# Altium project RYA_ESC.PrjPcb (part 1 of 2)
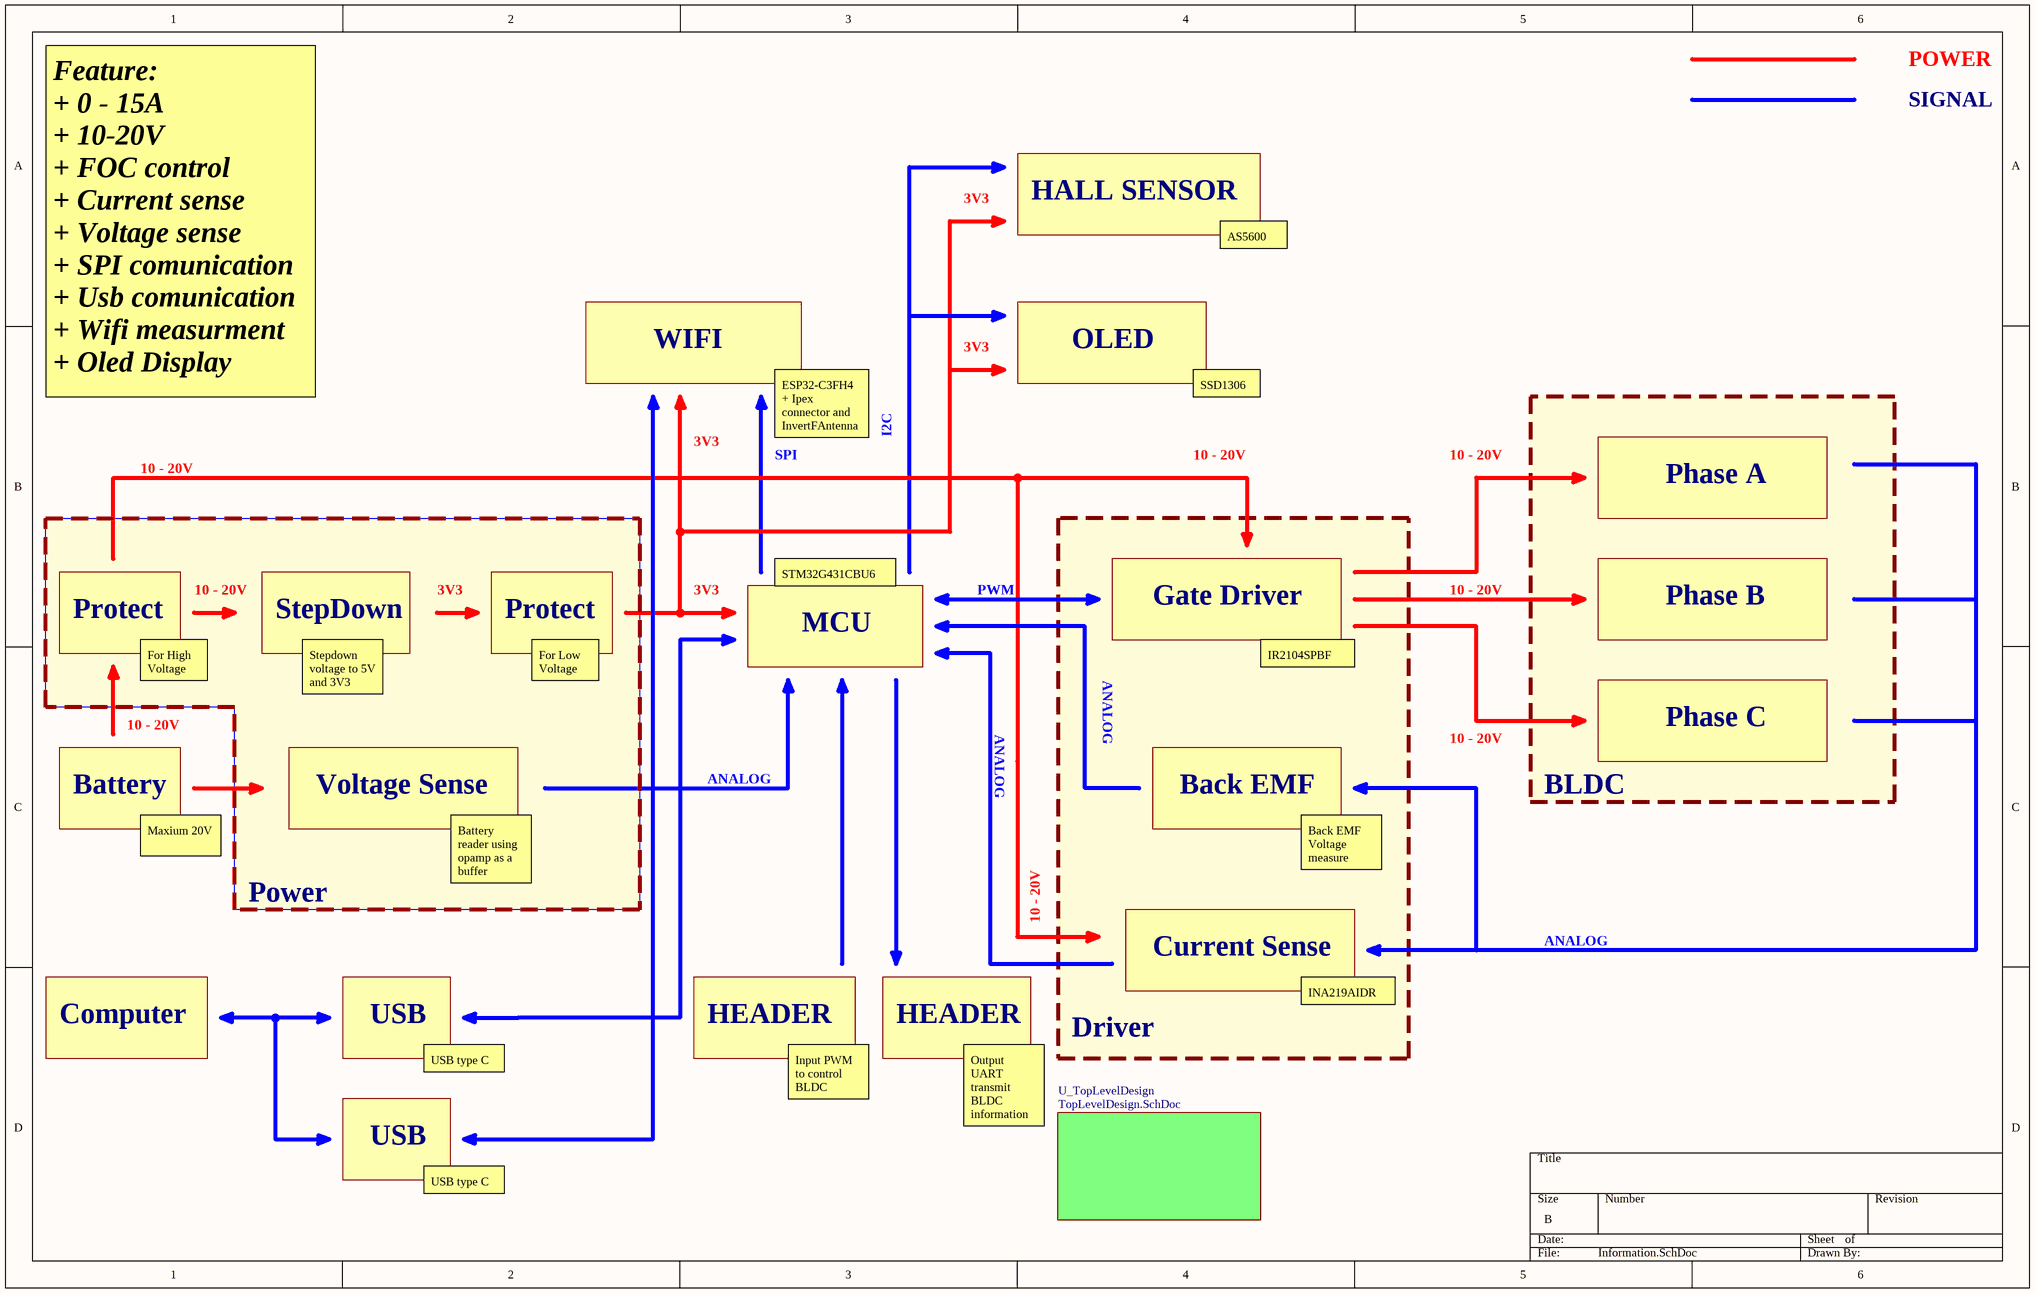
[diagram p0: Information.SchDoc]
15 sheets, 309 parts. Net scope: flat (ports and power ports of the same name join across sheets).
Board files: RYA_ESC.PcbDoc, Test.PcbDoc
Sheets:
  Information.SchDoc
    U_TopLevelDesign = TopLevelDesign.SchDoc
      ESP_USB = USB.SchDoc
      STM_USB = USB.SchDoc
      U_MCU = MCU.SchDoc
      U_OLED = OLED.SchDoc
      U_Wifi = Wifi.SchDoc
      U_Power = Power.SchDoc
        HighPowerProtect = HiPowerProtect.SchDoc
        U_Power = StepDown.SchDoc
          U_5VProtect = 5VProtect.SchDoc
        U_BattVoltSense = BattVoltSense.SchDoc
      U_Driver = Driver.SchDoc
        I_PhaseB = CurrentSense.SchDoc
        I_PhaseC = CurrentSense.SchDoc
        I_PhaseA = CurrentSense.SchDoc
        U_BackEMF = BackEMF.SchDoc
        PhaseB = GateDriver.SchDoc
        PhaseC = GateDriver.SchDoc
        PhaseA = GateDriver.SchDoc

## Sheet Information.SchDoc
size B; SheetNumber: 1; SheetTotal: 15

### Sub-sheets
U_TopLevelDesign = TopLevelDesign.SchDoc: no entries

### Notes on the sheet
- POWER
- SIGNAL
- 3V3
- HALL SENSOR
- AS5600
- WIFI
- OLED
- Feature:
  + 0 - 15A
  + 10-20V
  + FOC control
  + Current sense
  + Voltage sense
  + SPI comunication
  + Usb comunication
  + Wifi measurment
  + Oled Display
- ESP32-C3FH4 + Ipex connector and InvertFAntenna
- I2C
- SSD1306
- 10 - 20V
- SPI
- Phase A
- Protect
- StepDown
- STM32G431CBU6
- MCU
- PWM
- Gate Driver
- Phase B
- For High Voltage
- Stepdown voltage to 5V and 3V3
- For Low Voltage
- ANALOG
- IR2104SPBF
- Phase C
- Battery
- Voltage Sense
- Back EMF
- BLDC
- Maxium 20V
- Power
- Battery reader using opamp as a buffer
- Back EMF Voltage measure
- Current Sense
- Computer
- USB
- HEADER
- Driver
- INA219AIDR
- USB type C
- Input PWM to control BLDC
- Output UART transmit BLDC information

## Sheet TopLevelDesign.SchDoc
size B; SheetNumber: 2; SheetTotal: 15
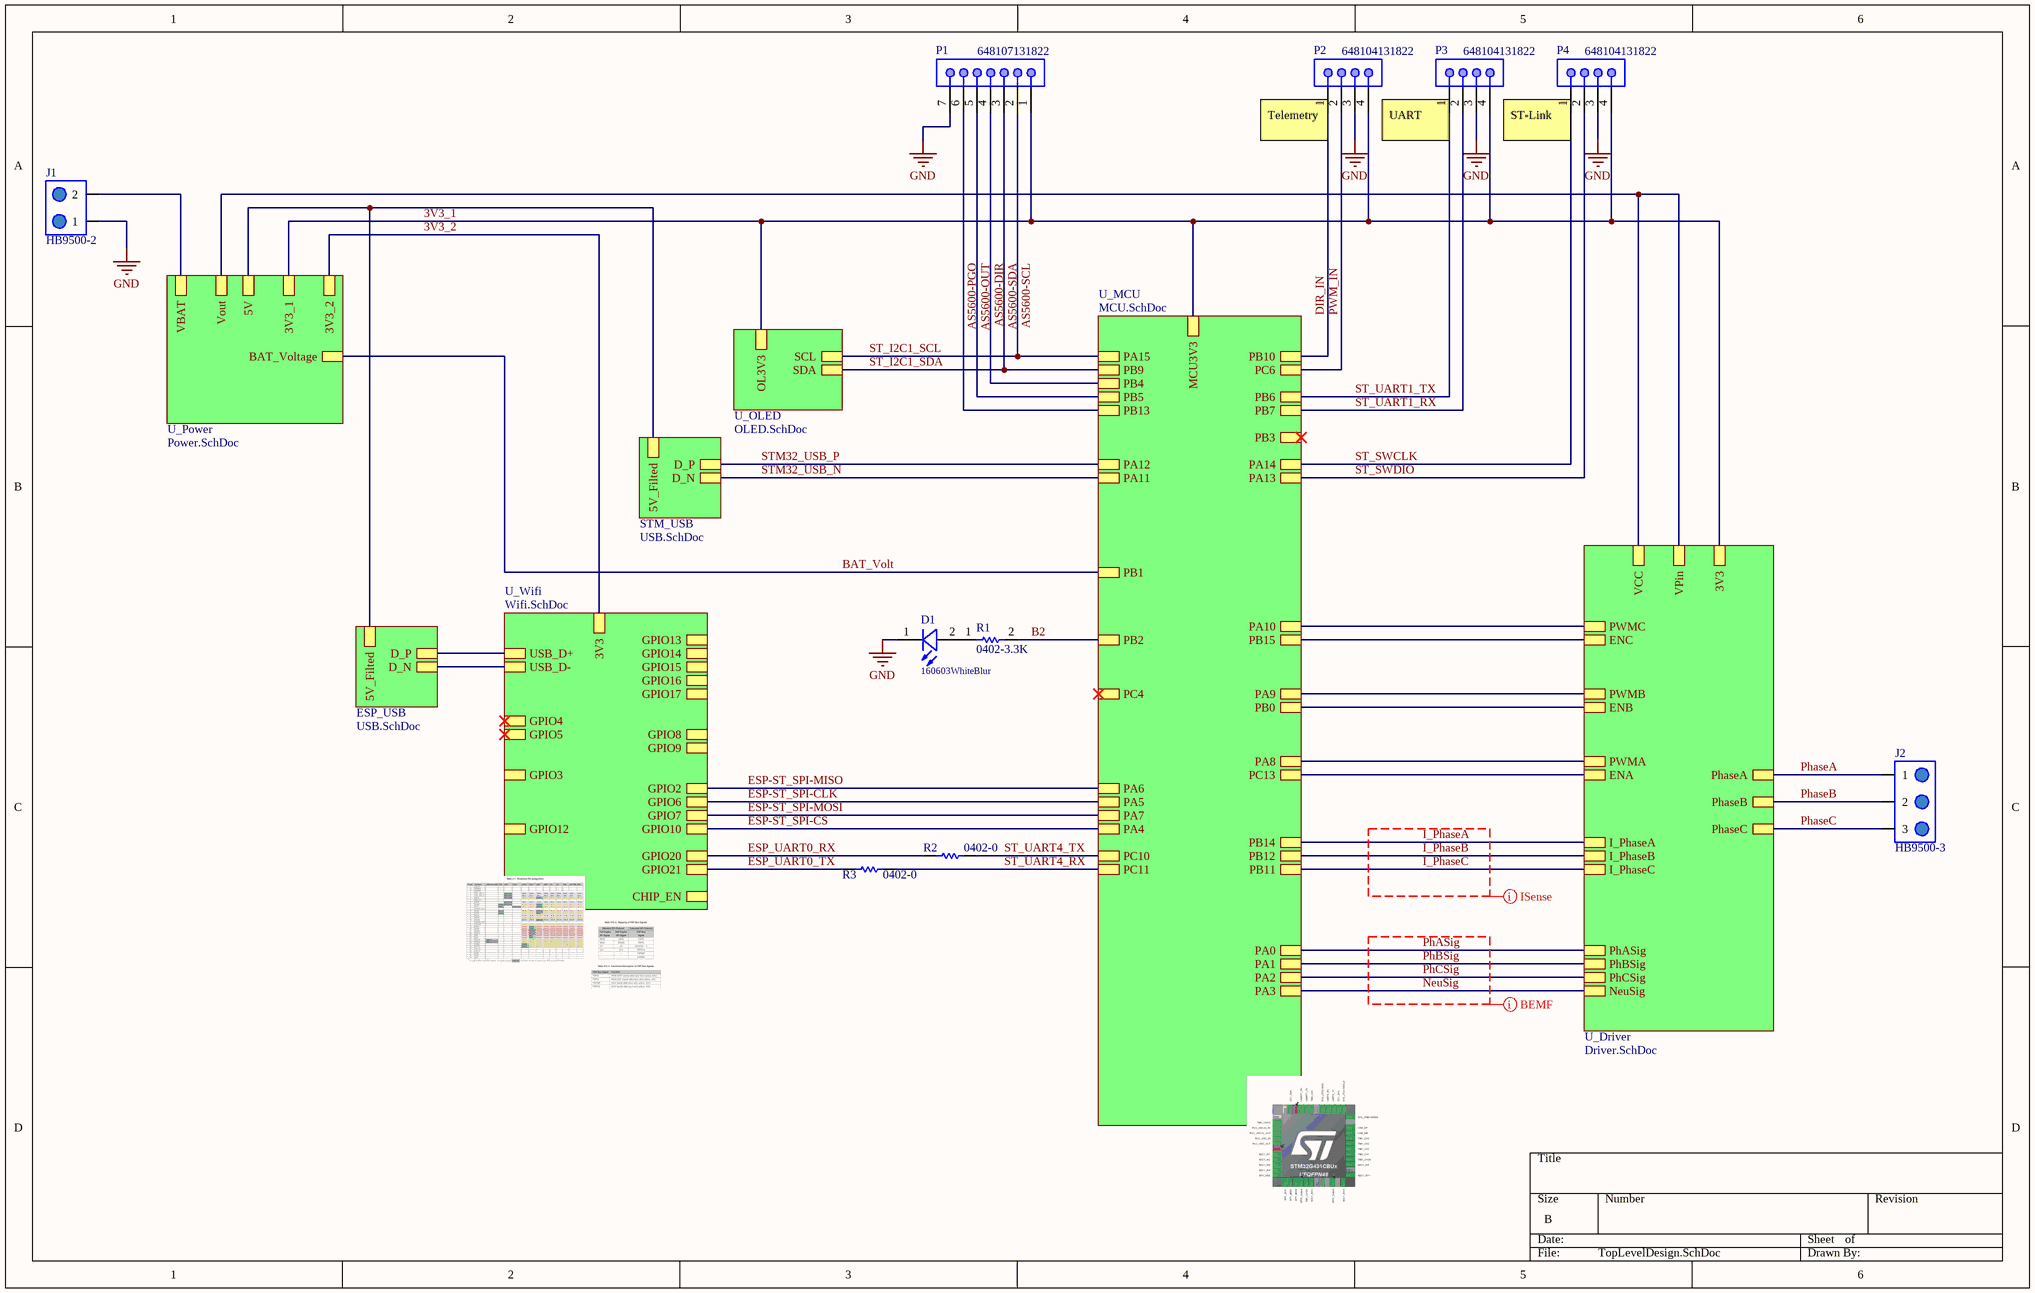
[diagram p1: TopLevelDesign.SchDoc]

### Parts
D1  160603WhiteBlur  [WL-SMCW_0603_H=0.7mm]
J1  HB9500-2  [HB9500-2]
J2  HB9500-3  [HB9500-3]
P1  648107131822  [648107131822]
P2  648104131822  [648104131822]
P3  648104131822  [648104131822]
P4  648104131822  [648104131822]
R1  0402-3.3K  [R-0402-10K]
R2  0402-0  [R-0402-1K]
R3  0402-0  [R-0402-1K]

### Sub-sheets
ESP_USB = USB.SchDoc: D_N, D_P, 5V_Filted
STM_USB = USB.SchDoc: D_N, D_P, 5V_Filted
U_Driver = Driver.SchDoc: VCC, VPin, 3V3, PhaseC, PhaseB, PhaseA, PWMC, ENC, PWMB, ENB, PWMA, ENA, I_PhaseC, I_PhaseB, I_PhaseA, PhASig, PhBSig, PhCSig, NeuSig
U_MCU = MCU.SchDoc: PB0, PB1, PB2, PB3, PB4, PB5, PB6, PB7, PB9, PB10, PB11, PB12, PB13, PB14, PB15, PC4, PC6, PC10, PC11, PC13, PA0, PA1, PA2, PA3, PA4, PA5, PA6, PA7, PA8, PA9, PA10, PA11, PA12, PA13, PA14, PA15, MCU3V3
U_OLED = OLED.SchDoc: OL3V3, SCL, SDA
U_Power = Power.SchDoc: VBAT, BAT_Voltage, 5V, 3V3_1, Vout, 3V3_2
U_Wifi = Wifi.SchDoc: 3V3, USB_D-, USB_D+, GPIO8, GPIO9, GPIO10, GPIO4, GPIO5, GPIO6, GPIO7, GPIO2, GPIO3, CHIP_EN, GPIO20, GPIO21, GPIO12, GPIO13, GPIO14, GPIO15, GPIO16, GPIO17

### Nets
GND: D1.1(K) J1.1 P1.7 P2.3 P3.3 P4.3
3V3_1: P1.1 P2.4 P3.4 P4.4 ; sheet U_MCU/MCU3V3, sheet U_OLED/OL3V3, sheet U_Power/3V3_1, sheet U_Driver/3V3
3V3_2: sheet U_Wifi/3V3, sheet U_Power/3V3_2
AS5600-DIR: P1.4 ; sheet U_MCU/PB4
AS5600-OUT: P1.5 ; sheet U_MCU/PB5
AS5600-PGO: P1.6 ; sheet U_MCU/PB13
AS5600-SCL: P1.2 ; sheet U_MCU/PA15, sheet U_OLED/SCL  [also labelled ST_I2C1_SCL]
AS5600-SDA: P1.3 ; sheet U_MCU/PB9, sheet U_OLED/SDA  [also labelled ST_I2C1_SDA]
B2: R1.2 ; sheet U_MCU/PB2
BAT_Volt: sheet U_MCU/PB1, sheet U_Power/BAT_Voltage
DIR_IN: P2.1 ; sheet U_MCU/PB10
ESP-ST_SPI-CLK: sheet U_MCU/PA5, sheet U_Wifi/GPIO6
ESP-ST_SPI-CS: sheet U_MCU/PA4, sheet U_Wifi/GPIO10
ESP-ST_SPI-MISO: sheet U_MCU/PA6, sheet U_Wifi/GPIO2
ESP-ST_SPI-MOSI: sheet U_MCU/PA7, sheet U_Wifi/GPIO7
ESP_UART0_RX: R2.1 ; sheet U_Wifi/GPIO20
ESP_UART0_TX: R3.1 ; sheet U_Wifi/GPIO21
I_PhaseA: sheet U_MCU/PB14, sheet U_Driver/I_PhaseA
I_PhaseB: sheet U_MCU/PB12, sheet U_Driver/I_PhaseB
I_PhaseC: sheet U_MCU/PB11, sheet U_Driver/I_PhaseC
NeuSig: sheet U_MCU/PA3, sheet U_Driver/NeuSig
PhaseA: J2.1 ; sheet U_Driver/PhaseA
PhaseB: J2.2 ; sheet U_Driver/PhaseB
PhaseC: J2.3 ; sheet U_Driver/PhaseC
PhASig: sheet U_MCU/PA0, sheet U_Driver/PhASig
PhBSig: sheet U_MCU/PA1, sheet U_Driver/PhBSig
PhCSig: sheet U_MCU/PA2, sheet U_Driver/PhCSig
PWM_IN: P2.2 ; sheet U_MCU/PC6
ST_SWCLK: P4.1 ; sheet U_MCU/PA14
ST_SWDIO: P4.2 ; sheet U_MCU/PA13
ST_UART1_RX: P3.2 ; sheet U_MCU/PB7
ST_UART1_TX: P3.1 ; sheet U_MCU/PB6
ST_UART4_RX: R3.2 ; sheet U_MCU/PC11
ST_UART4_TX: R2.2 ; sheet U_MCU/PC10
STM32_USB_N: sheet STM_USB/D_N, sheet U_MCU/PA11
STM32_USB_P: sheet STM_USB/D_P, sheet U_MCU/PA12
NetD1_2: D1.2(A) R1.1
NetJ1_2: J1.2 ; sheet U_Power/VBAT
(unnamed): sheet ESP_USB/D_N, sheet U_Wifi/USB_D-
(unnamed): sheet ESP_USB/D_P, sheet U_Wifi/USB_D+
(unnamed): sheet ESP_USB/5V_Filted, sheet STM_USB/5V_Filted, sheet U_Power/5V
(unnamed): sheet U_MCU/PB0, sheet U_Driver/ENB
(unnamed): sheet U_MCU/PB15, sheet U_Driver/ENC
(unnamed): sheet U_MCU/PC13, sheet U_Driver/ENA
(unnamed): sheet U_MCU/PA8, sheet U_Driver/PWMA
(unnamed): sheet U_MCU/PA9, sheet U_Driver/PWMB
(unnamed): sheet U_MCU/PA10, sheet U_Driver/PWMC
(unnamed): sheet U_Power/Vout, sheet U_Driver/VCC, sheet U_Driver/VPin

### Layout directives
net class BEMF: NeuSig, PhASig, PhBSig, PhCSig
net class ISense: I_PhaseA, I_PhaseB, I_PhaseC

### Notes on the sheet
- (near P2) Telemetry
- UART
- ST-Link

### Library data of the parts
D1 = CMP-004-00095-1: WL-SMCW SMT Mono-color Chip LED Blur, size 0603, White; ComponentLink3Description: Supplier 2 URL; Design Item ID: 160603WhiteBlur; Component Type: Standard; Size: 0603; Supplier 1 SN: 755-SMLEN3WBC8W1; Color: White; Supplier 3 Name: ICDayRoi; Supplier 3 URL: N/A; Pins: 2; Supplier 2 URL: https://www.digikey.com/en/products/detail/qt-brightek-qtb/QBLP601-IW/4814655; ComponentLink1URL: N/A; ComponentLink3URL: https://www.digikey.com/en/products/detail/qt-brightek-qtb/QBLP601-IW/4814655; Supplier 1 URL: https://www.mouser.vn/ProductDetail/ROHM-Semiconductor/SMLEN3WBC8W1?qs=W0yvOO0ixfGun78rr9Unsw%3D%3D; ComponentLink2URL: https://www.mouser.vn/ProductDetail/ROHM-Semiconductor/SMLEN3WBC8W1?qs=W0yvOO0ixfGun78rr9Unsw%3D%3D; ComponentLink4Description: Supplier 3 URL; Supplier 1 Name: Mouser; Supplier 3 SN: N/A; ComponentLink4URL: N/A; Source: WL-SMCW_0603.SchLib; Supplier 2 SN: 1516-1057-2-ND; Value: White; Supplier 2 Name: Digi-Key; ComponentLink2Description: Supplier 1 URL; ComponentLink1Description: Datasheet link; Type: Blur
J1 = CMP-118-000008-1: High Power Terminal , 25A , 300V; Pin Count: 2; Component Type: Standard; Design Item ID: HB9500-2; Source: HB9500-2.SchLib
J2 = CMP-118-000006-1: High Power Terminal , 25A , 300V; Design Item ID: HB9500-3; Component Type: Standard; Source: HB9500-3.SchLib; Pin Count: 3
P1 = CMP-002-01153-1: WR-WTB SMT Male Horizontal Shrouded Header, pitch 1.5mm, 7p; Working Voltage: 50VAC; Value: 1A, 50 V (AC); Rated Current: 1A; Contact Resistance: 20mOhm; Withstanding Voltage: 500VAC; Pin Number: 7; Operating Temperature: -25 to +85degC; ComponentLink3URL: https://www.we-online.com/en/components/products/WTB_1_50_SMT_MALE_HORIZONTAL_SHROUDED_HEADER_6481XX131822?sq=648107131822#648107131822; Supplier 2 URL: N/A; Supplier 1 URL: N/A; Supplier 1 Name: Mouser; Supplier 2 SN: N/A; Type: Horizontal; Source: WR-WTB_1.50mm.SchLib; Design Item ID: 648107131822; Supplier 3 SN: N/A; Pitch: 1.5mm; Part Number: 648107131822; Mounting Technology: SMT; ComponentLink1URL: http://www.we-online.de; Publisher: Wurth Elektronik; Packaging: Tape and Reel; ComponentLink3Description: Global Supply; ComponentLink2URL: https://www.we-online.com/catalog/datasheet/648107131822.pdf; Supplier 3 URL: N/A; Pins: 7; Supplier 1 SN: N/A; ComponentLink2Description: Datasheet; Supplier 2 Name: Digi-Key; Supplier 3 Name: thegioiic; ComponentLink1Description: Manufacturer; Component Type: Standard; Gender: Male; Published Date: January 2020
P2-P4 = CMP-002-01150-1: WR-WTB SMT Male Horizontal Shrouded Header, pitch 1.5mm, 4p; Working Voltage: 50VAC; Rated Current: 1A; Contact Resistance: 20mOhm; Pin Number: 4; Value: 1A, 50 V (AC); Withstanding Voltage: 500VAC; ComponentLink4URL: https://www.mouser.vn/ProductDetail/Wurth-Elektronik/648104131822?qs=ZtY9WdtwX57XPjIMVYKZ6w%3D%3D; ComponentLink3URL: https://www.we-online.com/en/components/products/WTB_1_50_SMT_MALE_HORIZONTAL_SHROUDED_HEADER_6481XX131822?sq=648104131822#648104131822; ComponentLink2Description: Datasheet; Supplier 3 URL: N/A; Mounting Technology: SMT; Operating Temperature: -25 to +85degC; Packaging: Tape and Reel; Pins: 4; Component Type: Standard; ComponentLink4Description: Global Supply; Supplier 1 URL: https://www.mouser.vn/ProductDetail/Wurth-Elektronik/648104131822?qs=ZtY9WdtwX57XPjIMVYKZ6w%3D%3D; Supplier 2 URL: N/A; Supplier 3 SN: N/A; Design Item ID: 648104131822; Supplier 1 Name: Mouser; Supplier 2 Name: Digi-Key; Supplier 2 SN: N/A; ComponentLink3Description: Global Supply; Part Number: 648104131822; Supplier 3 Name: thegioiic; Type: Horizontal; Gender: Male; Publisher: Wurth Elektronik; ComponentLink1Description: Manufacturer; Published Date: January 2020; Supplier 1 SN: 710-648104131822; ComponentLink1URL: http://www.we-online.de; Source: WR-WTB_1.50mm.SchLib; ComponentLink2URL: https://www.we-online.com/catalog/datasheet/648104131822.pdf; Pitch: 1.5mm
R1 = CMP-009-00688-1: RES 0402 3.3K; Value: 3.3k
R2 R3 = CMP-009-00678-4: 0402Resistor 0 Ohm; Value: 0

## Sheet USB.SchDoc
size B; SheetNumber: 13; SheetTotal: 15
Used 2 times, as channels U_TopLevelDesign/ESP_USB, U_TopLevelDesign/STM_USB. Parts and nets are listed once, with the designators drawn on the sheet.
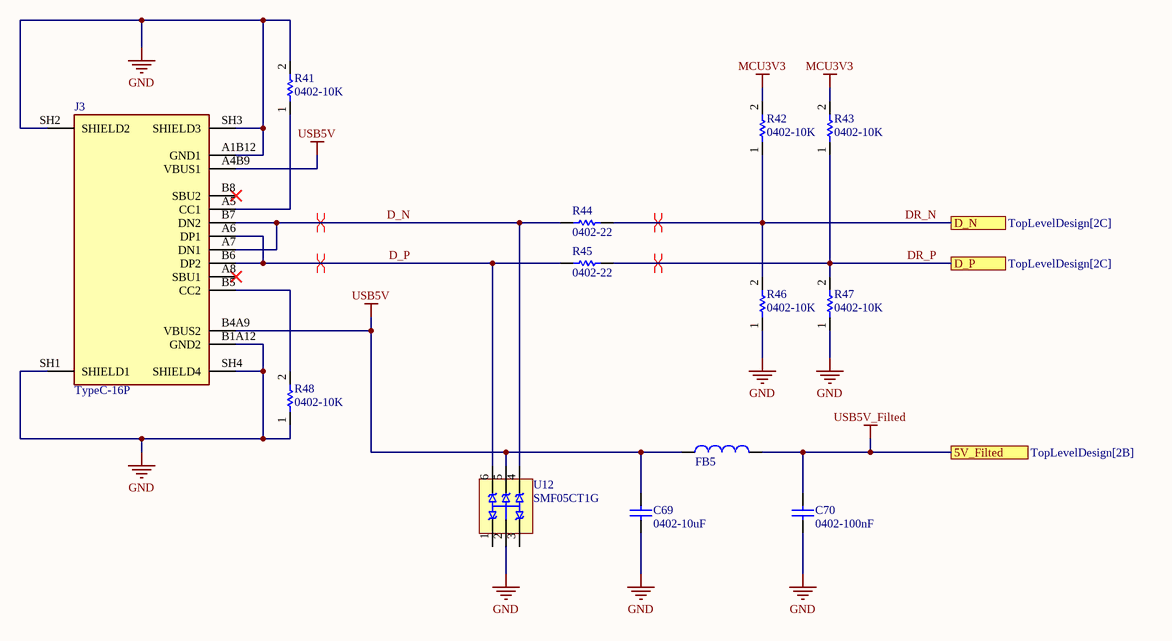
[diagram p2: USB.SchDoc]

### Parts
C69  0402-10uF  [CAPC0402(1005)60_N]
C70  0402-100nF  [CAPC0402(1005)60_N]
FB5  03060360110225  [FER_0603]  (value not drawn)
J3  TypeC-16P  [MOLEX_2171790001]
R41  0402-10K  [R-0402-10K]
R42  0402-10K  [R-0402-10K]
R43  0402-10K  [R-0402-10K]
R44  0402-22  [R-0402-1K]
R45  0402-22  [R-0402-1K]
R46  0402-10K  [R-0402-10K]
R47  0402-10K  [R-0402-10K]
R48  0402-10K  [R-0402-10K]
U12  SMF05CT1G  [SOT65P210X110-6N]

### Ports
5V_Filted (see TopLevelDesign[2B]), D_N (see TopLevelDesign[2C]), D_P (see TopLevelDesign[2C])

### Nets
GND: C69.1 C70.1 J3.A1B12(GND1) J3.B1A12(GND2) J3.SH1(SHIELD1) J3.SH2(SHIELD2) J3.SH3(SHIELD3) J3.SH4(SHIELD4) R41.2 R46.1 R47.1 R48.1 U12.2(A)
MCU3V3: R42.2 R43.2
USB5V: C69.2 FB5.1 J3.A4B9(VBUS1) J3.B4A9(VBUS2) U12.5(C4)
USB5V_Filted: C70.2 FB5.2 ; port 5V_Filted
D_N: J3.A7(DN1) J3.B7(DN2) R44.1 U12.4(C3)
D_P: J3.A6(DP1) J3.B6(DP2) R45.1 U12.6(C5)
DR_N: R42.1 R44.2 R46.2 ; port D_N
DR_P: R43.1 R45.2 R47.2 ; port D_P
NetJ3_A5: J3.A5(CC1) R41.1
NetJ3_B5: J3.B5(CC2) R48.2

Not connected (* = marked no-connect by the designer): J3 A8(SBU1)* B8(SBU2)*; U12 1(C1) 3(C2)

### Channels
U_TopLevelDesign/ESP_USB: designators end in _ESP_USB; ports 5V_Filted=USB5V_Filted D_N=DR_N D_P=DR_P
U_TopLevelDesign/STM_USB: designators end in _STM_USB; ports 5V_Filted=USB5V_Filted D_N=DR_N D_P=DR_P

### Layout directives
differential pair; differential pair class USB_In; rule Matched Net Lengths [Delay Tolerance = 5ps]: D_N_ESP_USB, D_P_ESP_USB
differential pair; differential pair class USB_Out; rule Matched Net Lengths [Delay Tolerance = 5ps]: DR_N, DR_P

### Library data of the parts
C69 = CMP-001-00352-3: Capacitor 10uF 0402s; Tolerance: 20%; Value: 10µF; Dielectric: X5R; Voltage Rating (DC): 4V; Width: 0.02inch; Packaging: Tape and Reel; RoHS Compliant: Yes; Series: M; Mount: Surface Mount; Termination: SMD/SMT; Source: 0402-10uF.SchLib; Design Item ID: CMP-1034-02139-2; Min Operating Temperature: -55°C; Construction: Flat; Component Type: Standard; Case Code (Metric): 1005; Length: 0.039inch; Height: 0.5mm; Pins: 2; Thickness: 0.028inch; Voltage Rating: 4V; Package Quantity: 1; Max Operating Temperature: 85°C; Halogen Free: Halogen Free; Case/Package: 0402
C70 = CMP-001-00354-3: Capacitor 100nF 0402; Tolerance: 20%; Voltage Rating (DC): 4V; Dielectric: X5R; Series: M; RoHS Compliant: Yes; Max Operating Temperature: 85°C; Length: 0.039inch; Thickness: 0.028inch; Mount: Surface Mount; Min Operating Temperature: -55°C; Height: 0.5mm; Packaging: Tape and Reel; Construction: Flat; Termination: SMD/SMT; Source: 0402-10uF.SchLib; Design Item ID: CMP-1034-02139-2; Case/Package: 0402; Voltage Rating: 4V; Pins: 2; Value: 100nF; Width: 0.02inch; Component Type: Standard; Package Quantity: 1; Halogen Free: Halogen Free; Case Code (Metric): 1005
FB5 = CMP-006-00090-1: Ferrite, 0603, 600 Ohms, 1 A; Manufacture Name: Wurth Elektronik; Manufacture SN: 742792651; Maximum DC Resistance: 200 mOhms; Maximum DC Current: 1 A; Test Frequency: 100MHz; Tolerance: 25%; Design Item ID: 03060360110225; Impedance: 600 Ohms; Supplier 2 URL: N/A; Supplier 1 URL: https://www.mouser.com/ProductDetail/Wurth-Elektronik/742792651?qs=sGAEpiMZZMt1hubY80%2Fs8M60rIzA20dgTaAssd1%2FEf4%3D&utm_source=mouser-refine-download&utm_medium=file&utm_campaign=742792651&utm_content=Wurth-Elektronik; Supplier 1 SN: 710-742792651; Size: 0603; Operating Temperature: -55 to +125degC; Supplier 1 Name: Mouser; Packaging: Tape and Reel; Pins: 2; Supplier 2 SN: N/A; Supplier 3 Name: thegioiic; Supplier 3 URL: N/A; Supplier 2 Name: Digi-Key; Source: Ferrite_Bead_0603.SchLib; Mounting Technology: SMT; Supplier 3 SN: N/A; Component Type: Standard
J3 = CMP-002-01572-3: USB Type C - Connector, Top-mount SMT, 16pos; MF: Molex; MP: 217179-0001; Check_prices: https://www.snapeda.com/parts/217179-0001/Molex/view-part/?ref=eda; Design Item ID: 2171790001; Component Type: Standard; SnapEDA_Link: https://www.snapeda.com/parts/217179-0001/Molex/view-part/?ref=snap; Case/Package: None; Value: *; Source: 2171790001.SchLib; Pins: 16
R41-R43 R46-R48 = CMP-009-00675-4: RES 0402 10K; Value: 10k
R44 R45 = CMP-009-00695-1: 0402Resistor 22Ohm; Value: 22
U12 = CMP-004-00115-2: 12.5V Clamp 8A (8/20Âµs) Ipp Tvs Diode Surface Mount SC-88/SC70-6/SOT-363; MF: ON Semiconductor; Case/Package: SC-88-6 ON Semiconductor; Check_prices: https://www.snapeda.com/parts/SMF05CT1G/Onsemi/view-part/?ref=eda; Component Type: Standard; MP: SMF05CT1G; Pins: 6; Value: *; SnapEDA_Link: https://www.snapeda.com/parts/SMF05CT1G/Onsemi/view-part/?ref=snap; Source: SMF05CT1G.SchLib; Design Item ID: SMF05CT1G

## Sheet MCU.SchDoc
size B; SheetNumber: 3; SheetTotal: 15; SPICEModelCacheWVSDJHDF: <root> / <DocumentId>WVSDJHDF</DocumentId> / </root>
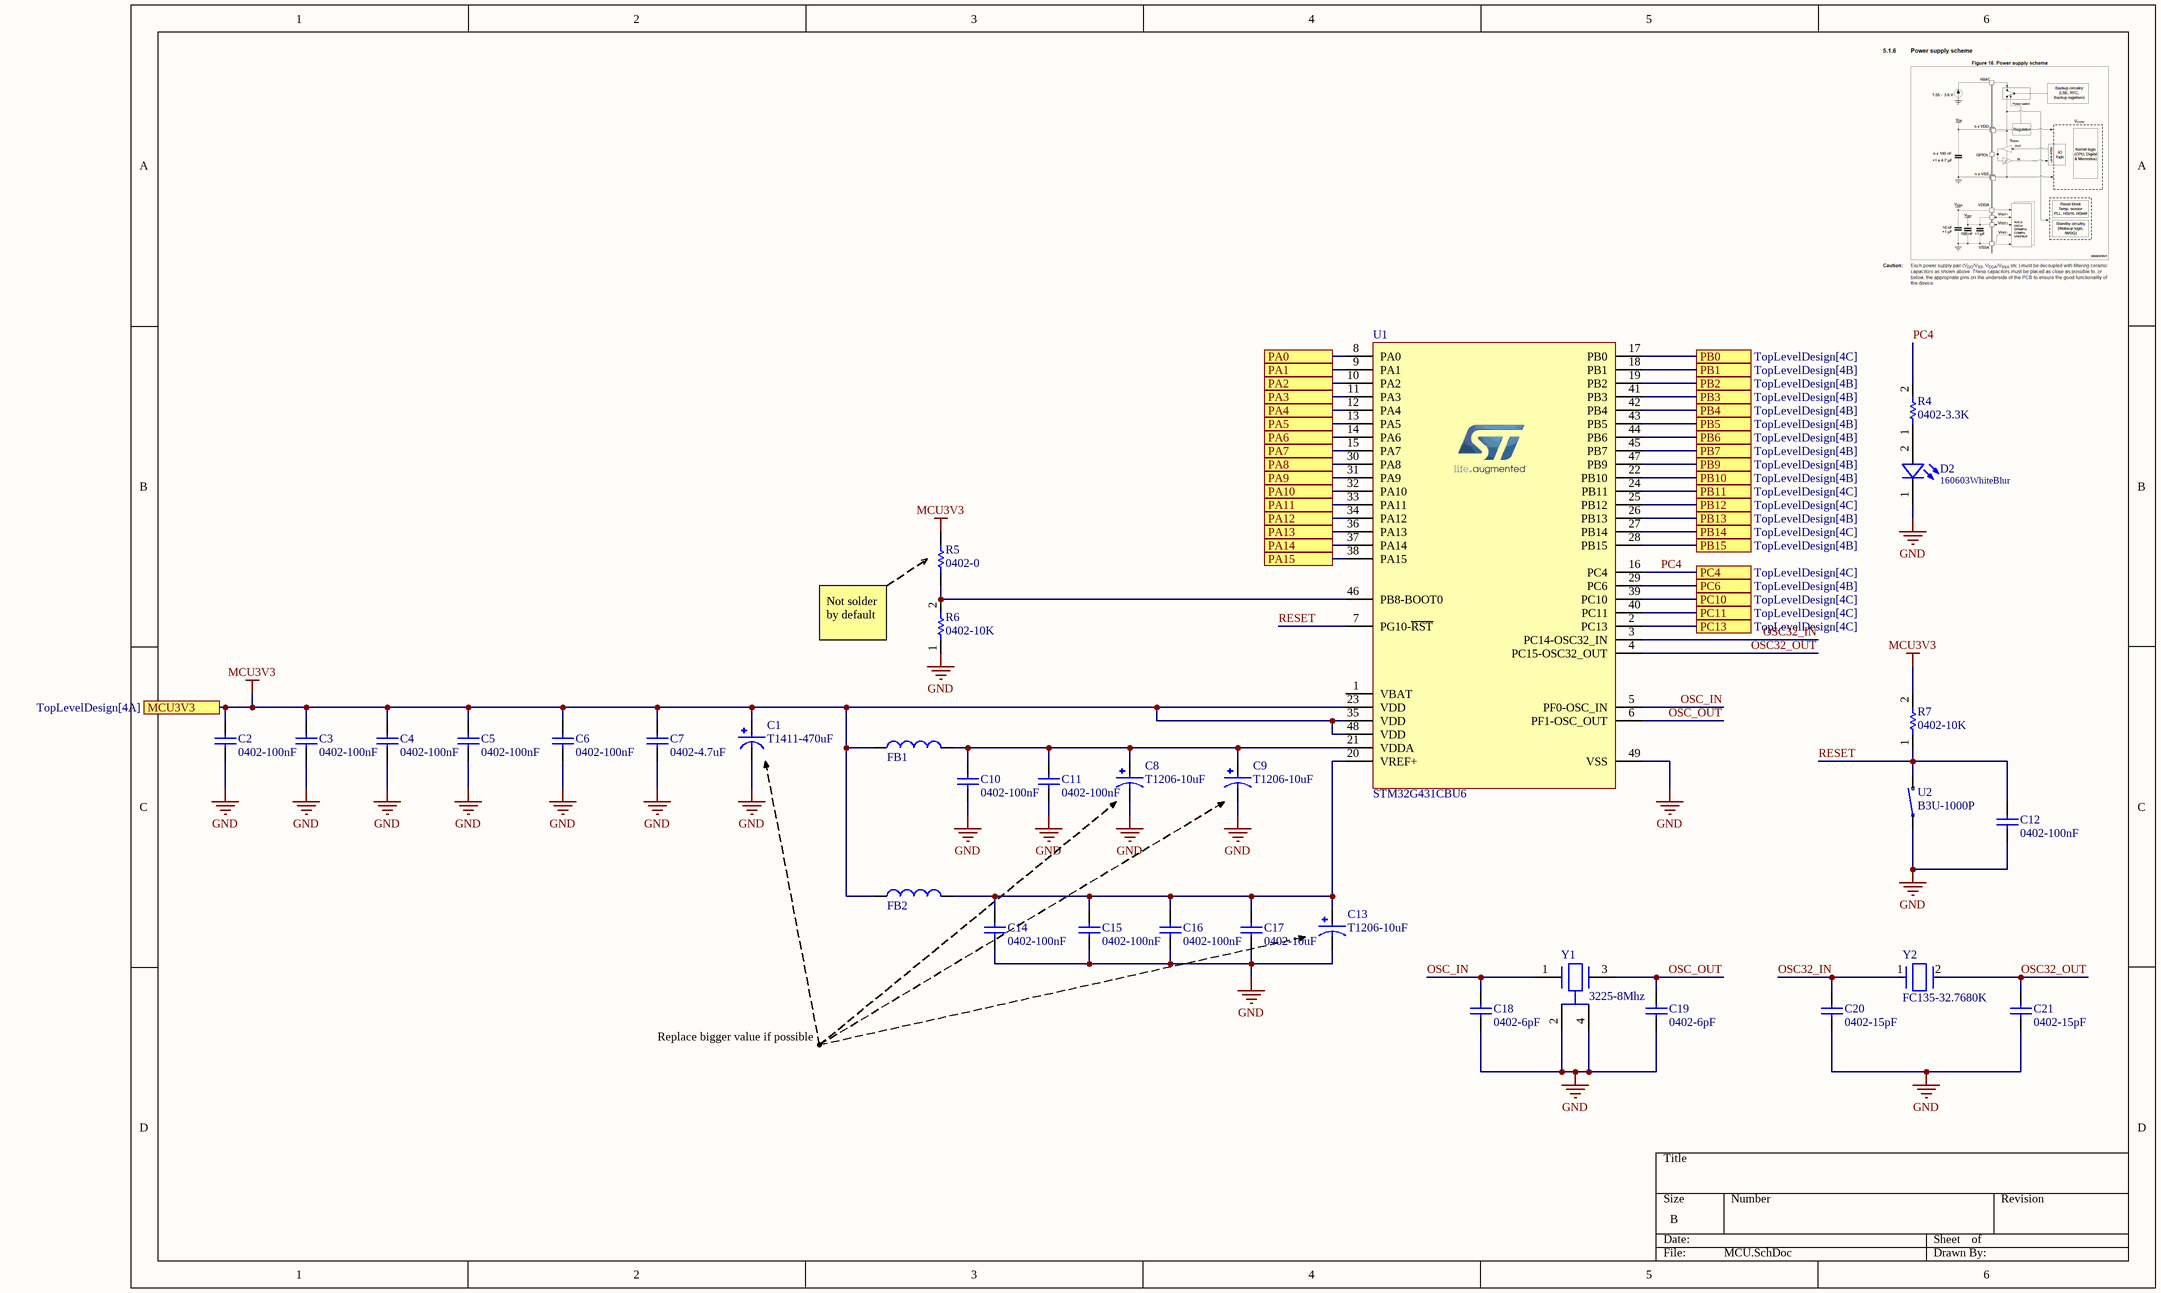
[diagram p3: MCU.SchDoc]

### Parts
C1  T1411-470uF  [CAPPC3528X210N]
C2  0402-100nF  [CAPC0402(1005)60_N]
C3  0402-100nF  [CAPC0402(1005)60_N]
C4  0402-100nF  [CAPC0402(1005)60_N]
C5  0402-100nF  [CAPC0402(1005)60_N]
C6  0402-100nF  [CAPC0402(1005)60_N]
C7  0402-4.7uF  [CAPC0402(1005)60_N]
C8  T1206-10uF  [CAPMP3216X180N]
C9  T1206-10uF  [CAPMP3216X180N]
C10  0402-100nF  [CAPC0402(1005)60_N]
C11  0402-100nF  [CAPC0402(1005)60_N]
C12  0402-100nF  [CAPC0402(1005)60_N]
C13  T1206-10uF  [CAPMP3216X180N]
C14  0402-100nF  [CAPC0402(1005)60_N]
C15  0402-100nF  [CAPC0402(1005)60_N]
C16  0402-100nF  [CAPC0402(1005)60_N]
C17  0402-10uF  [CAPC0402(1005)60_N]
C18  0402-6pF  [CAPC0402(1005)60_N]
C19  0402-6pF  [CAPC0402(1005)60_N]
C20  0402-15pF  [CAPC0402(1005)60_N]
C21  0402-15pF  [CAPC0402(1005)60_N]
D2  160603WhiteBlur  [WL-SMCW_0603_H=0.7mm]
FB1  03060360110225  [FER_0603]  (value not drawn)
FB2  03060360110225  [FER_0603]  (value not drawn)
R4  0402-3.3K  [R-0402-10K]
R5  0402-0  [R-0402-1K]
R6  0402-10K  [R-0402-10K]
R7  0402-10K  [R-0402-10K]
U1  STM32G431CBU6  [QFN50P700X700X60-49N]
U2  B3U-1000P  [SODFL4025X160N]
Y1  3225-8Mhz  [FP-NX3225SA-MFG]
Y2  FC135-32.7680K  [FP-FC-135-MFG]

### Ports
MCU3V3 (see TopLevelDesign[4A]), PA0 (see TopLevelDesign[4C]), PA1 (see TopLevelDesign[4C]), PA2 (see TopLevelDesign[4D]), PA3 (see TopLevelDesign[4D]), PA4 (see TopLevelDesign[4C]), PA5 (see TopLevelDesign[4C]), PA6 (see TopLevelDesign[4C]), PA7 (see TopLevelDesign[4C]), PA8 (see TopLevelDesign[4C]), PA9 (see TopLevelDesign[4C]), PA10 (see TopLevelDesign[4B]), PA11 (see TopLevelDesign[4B]), PA12 (see TopLevelDesign[4B]), PA13 (see TopLevelDesign[4B]), PA14 (see TopLevelDesign[4B]), PA15 (see TopLevelDesign[4B]), PB0 (see TopLevelDesign[4C]), PB1 (see TopLevelDesign[4B]), PB2 (see TopLevelDesign[4B]), PB3 (see TopLevelDesign[4B]), PB4 (see TopLevelDesign[4B]), PB5 (see TopLevelDesign[4B]), PB6 (see TopLevelDesign[4B]), PB7 (see TopLevelDesign[4B]), PB9 (see TopLevelDesign[4B]), PB10 (see TopLevelDesign[4B]), PB11 (see TopLevelDesign[4C]), PB12 (see TopLevelDesign[4C]), PB13 (see TopLevelDesign[4B]), PB14 (see TopLevelDesign[4C]), PB15 (see TopLevelDesign[4B]), PC4 (see TopLevelDesign[4C]), PC6 (see TopLevelDesign[4B]), PC10 (see TopLevelDesign[4C]), PC11 (see TopLevelDesign[4C]), PC13 (see TopLevelDesign[4C])

### Nets
GND: C1.2 C2.1 C3.1 C4.1 C5.1 C6.1 C7.1 C8.2 C9.2 C10.1 C11.1 C12.1 C13.2 C14.1 C15.1 C16.1 C17.1 C18.1 C19.1 C20.1 C21.1 D2.1(K) R6.1 U1.49(VSS) U2.1 Y1.2(GND) Y1.4(GND)
MCU3V3: C1.1 C2.2 C3.2 C4.2 C5.2 C6.2 C7.2 FB1.1 FB2.1 R5.2 R7.2 U1.23(VDD) U1.35(VDD) U1.48(VDD) ; port MCU3V3
OSC32_IN: C20.2 U1.3(PC14-OSC32_IN) Y2.1
OSC32_OUT: C21.2 U1.4(PC15-OSC32_OUT) Y2.2
OSC_IN: C18.2 U1.5(PF0-OSC_IN) Y1.1
OSC_OUT: C19.2 U1.6(PF1-OSC_OUT) Y1.3
PC4: R4.2 U1.16(PC4) ; port PC4
RESET: C12.2 R7.1 U1.7(PG10-~{RST}) U2.2
NetC8_1: C8.1 C9.1 C10.2 C11.2 FB1.2 U1.21(VDDA)
NetC13_1: C13.1 C14.2 C15.2 C16.2 C17.2 FB2.2 U1.20(VREF+)
NetD2_2: D2.2(A) R4.1
NetR5_1: R5.1 R6.2 U1.46(PB8-BOOT0)
NetU1_2: U1.2(PC13) ; port PC13
NetU1_8: U1.8(PA0) ; port PA0
NetU1_9: U1.9(PA1) ; port PA1
NetU1_10: U1.10(PA2) ; port PA2
NetU1_11: U1.11(PA3) ; port PA3
NetU1_12: U1.12(PA4) ; port PA4
NetU1_13: U1.13(PA5) ; port PA5
NetU1_14: U1.14(PA6) ; port PA6
NetU1_15: U1.15(PA7) ; port PA7
NetU1_17: U1.17(PB0) ; port PB0
NetU1_18: U1.18(PB1) ; port PB1
NetU1_19: U1.19(PB2) ; port PB2
NetU1_22: U1.22(PB10) ; port PB10
NetU1_24: U1.24(PB11) ; port PB11
NetU1_25: U1.25(PB12) ; port PB12
NetU1_26: U1.26(PB13) ; port PB13
NetU1_27: U1.27(PB14) ; port PB14
NetU1_28: U1.28(PB15) ; port PB15
NetU1_29: U1.29(PC6) ; port PC6
NetU1_30: U1.30(PA8) ; port PA8
NetU1_31: U1.31(PA9) ; port PA9
NetU1_32: U1.32(PA10) ; port PA10
NetU1_33: U1.33(PA11) ; port PA11
NetU1_34: U1.34(PA12) ; port PA12
NetU1_36: U1.36(PA13) ; port PA13
NetU1_37: U1.37(PA14) ; port PA14
NetU1_38: U1.38(PA15) ; port PA15
NetU1_39: U1.39(PC10) ; port PC10
NetU1_40: U1.40(PC11) ; port PC11
NetU1_41: U1.41(PB3) ; port PB3
NetU1_42: U1.42(PB4) ; port PB4
NetU1_43: U1.43(PB5) ; port PB5
NetU1_44: U1.44(PB6) ; port PB6
NetU1_45: U1.45(PB7) ; port PB7
NetU1_47: U1.47(PB9) ; port PB9

Not connected (* = marked no-connect by the designer): U1 1(VBAT)

### Notes on the sheet
- Not solder by default
- Replace bigger value if possible

### Library data of the parts
C1 = CMP-001-00375-1: 470 µF Molded Tantalum Polymer Capacitor 25 V 1411 (3528 Metric), 1210 150mOhm @ 100kHz; Value: 470µF; MP: TCJB106M025R0150; MF: AVX; SnapEDA_Link: https://www.snapeda.com/parts/TCJB106M025R0150/AVX/view-part/?ref=snap; Check_prices: https://www.snapeda.com/parts/TCJB106M025R0150/AVX/view-part/?ref=eda; Pins: 2; Design Item ID: TCJB106M025R0150; Component Type: Standard; Source: TCJB106M025R0150.SchLib; Case/Package: 1210 AVX
C2-C6 C10-C12 C14-C16 = CMP-001-00354-3: as C70 on sheet USB; Series: M; RoHS Compliant: Yes; Max Operating Temperature: 85°C; Length: 0.039inch; Thickness: 0.028inch; Mount: Surface Mount; Min Operating Temperature: -55°C; Height: 0.5mm; Packaging: Tape and Reel; Construction: Flat; Termination: SMD/SMT; Source: 0402-10uF.SchLib; Design Item ID: CMP-1034-02139-2; Case/Package: 0402; Voltage Rating: 4V; Pins: 2; Value: 100nF; Width: 0.02inch; Component Type: Standard; Package Quantity: 1; Halogen Free: Halogen Free; Case Code (Metric): 1005
C7 = CMP-001-00364-1: Capacitor 4.7uF 0402; Voltage Rating: 4V; Tolerance: 20%; Dielectric: X5R; Value: 4.7µF; Series: M; Width: 0.02inch; Halogen Free: Halogen Free; Construction: Flat; Pins: 2; Min Operating Temperature: -55°C; RoHS Compliant: Yes; Max Operating Temperature: 85°C; Thickness: 0.028inch; Package Quantity: 1; Mount: Surface Mount; Component Type: Standard; Packaging: Tape and Reel; Case Code (Metric): 1005; Case/Package: 0402; Voltage Rating (DC): 4V; Length: 0.039inch; Source: 0402-10uF.SchLib; Termination: SMD/SMT; Design Item ID: CMP-1034-02139-2; Height: 0.5mm
C8 C9 C13 = CMP-001-00370-3: Tantalum Capacitors - Polymer SMD 6.3V 47uF 1206 10% ESR=150mOhms; MP: T543A476K006ATW150; MF: KEMET; Value: 10µF; Source: T543A476K006ATW150.SchLib; Design Item ID: T543A476K006ATW150; Check_prices: https://www.snapeda.com/parts/T543A476K006ATW150/KEMET/view-part/?ref=eda; Case/Package: SMD-2 Kemet; Component Type: Standard; SnapEDA_Link: https://www.snapeda.com/parts/T543A476K006ATW150/KEMET/view-part/?ref=snap; Pins: 2
C17 = CMP-001-00352-3: as C69 on sheet USB; Width: 0.02inch; Packaging: Tape and Reel; RoHS Compliant: Yes; Series: M; Mount: Surface Mount; Termination: SMD/SMT; Source: 0402-10uF.SchLib; Design Item ID: CMP-1034-02139-2; Min Operating Temperature: -55°C; Construction: Flat; Component Type: Standard; Case Code (Metric): 1005; Length: 0.039inch; Height: 0.5mm; Pins: 2; Thickness: 0.028inch; Voltage Rating: 4V; Package Quantity: 1; Max Operating Temperature: 85°C; Halogen Free: Halogen Free; Case/Package: 0402
C18 C19 = CMP-001-00362-3: Capacitor 6pF 0402; Dielectric: X5R; Voltage Rating: 4V; Tolerance: 20%; Source: 0402-10uF.SchLib; Case Code (Metric): 1005; Case/Package: 0402; Mount: Surface Mount; Component Type: Standard; Packaging: Tape and Reel; Construction: Flat; RoHS Compliant: Yes; Series: M; Width: 0.02inch; Max Operating Temperature: 85°C; Min Operating Temperature: -55°C; Pins: 2; Height: 0.5mm; Package Quantity: 1; Length: 0.039inch; Thickness: 0.028inch; Value: 6pF; Design Item ID: CMP-1034-02139-2; Halogen Free: Halogen Free; Termination: SMD/SMT; Voltage Rating (DC): 4V
C20 C21 = CMP-001-00374-1: Capacitor 15pF 0402; Voltage Rating: 4V; Tolerance: 20%; Dielectric: X5R; Packaging: Tape and Reel; Length: 0.039inch; Max Operating Temperature: 85°C; Design Item ID: CMP-1034-02139-2; Value: 15pF; Min Operating Temperature: -55°C; Case Code (Metric): 1005; Voltage Rating (DC): 4V; Case/Package: 0402; RoHS Compliant: Yes; Height: 0.5mm; Halogen Free: Halogen Free; Construction: Flat; Thickness: 0.028inch; Component Type: Standard; Source: 0402-10uF.SchLib; Termination: SMD/SMT; Mount: Surface Mount; Width: 0.02inch; Pins: 2; Series: M; Package Quantity: 1
D2 = CMP-004-00095-1: as D1 on sheet TopLevelDesign; ComponentLink3Description: Supplier 2 URL; Design Item ID: 160603WhiteBlur; Component Type: Standard; Size: 0603; Supplier 1 SN: 755-SMLEN3WBC8W1; Color: White; Supplier 3 Name: ICDayRoi; Supplier 3 URL: N/A; Pins: 2; Supplier 2 URL: https://www.digikey.com/en/products/detail/qt-brightek-qtb/QBLP601-IW/4814655; ComponentLink1URL: N/A; ComponentLink3URL: https://www.digikey.com/en/products/detail/qt-brightek-qtb/QBLP601-IW/4814655; Supplier 1 URL: https://www.mouser.vn/ProductDetail/ROHM-Semiconductor/SMLEN3WBC8W1?qs=W0yvOO0ixfGun78rr9Unsw%3D%3D; ComponentLink2URL: https://www.mouser.vn/ProductDetail/ROHM-Semiconductor/SMLEN3WBC8W1?qs=W0yvOO0ixfGun78rr9Unsw%3D%3D; ComponentLink4Description: Supplier 3 URL; Supplier 1 Name: Mouser; Supplier 3 SN: N/A; ComponentLink4URL: N/A; Source: WL-SMCW_0603.SchLib; Supplier 2 SN: 1516-1057-2-ND; Value: White; Supplier 2 Name: Digi-Key; ComponentLink2Description: Supplier 1 URL; ComponentLink1Description: Datasheet link; Type: Blur
FB1 FB2 = CMP-006-00090-1: Ferrite, 0603, 600 Ohms, 300 mA; Manufacture Name: Wurth Elektronik; Manufacture SN: 742792651; Maximum DC Resistance: 200 mOhms; Maximum DC Current: 1 A; Test Frequency: 100MHz; Tolerance: 25%; Design Item ID: 03060360110225; Impedance: 600 Ohms; Supplier 2 URL: N/A; Supplier 1 URL: https://www.mouser.com/ProductDetail/Wurth-Elektronik/742792651?qs=sGAEpiMZZMt1hubY80%2Fs8M60rIzA20dgTaAssd1%2FEf4%3D&utm_source=mouser-refine-download&utm_medium=file&utm_campaign=742792651&utm_content=Wurth-Elektronik; Supplier 1 SN: 710-742792651; Size: 0603; Operating Temperature: -55 to +125degC; Supplier 1 Name: Mouser; Packaging: Tape and Reel; Pins: 2; Supplier 2 SN: N/A; Supplier 3 Name: thegioiic; Supplier 3 URL: N/A; Supplier 2 Name: Digi-Key; Source: Ferrite_Bead_0603.SchLib; Mounting Technology: SMT; Supplier 3 SN: N/A; Component Type: Standard
R4 = CMP-009-00688-1: RES 0402 3.3K; Value: 3.3k
R5 = CMP-009-00678-4: 0402Resistor 0 Ohm; Value: 0
R6 R7 = CMP-009-00675-4: RES 0402 10K; Value: 10k
U1 = CMP-031-00017-3: ARMÂ® CortexÂ®-M4F STM32G4 Microcontroller IC 32-Bit Single-Core 170MHz 128KB (128K x 8) FLASH 48-UFQFPN (7x7); MF: STMicroelectronics; Case/Package: UFQFPN-48 STMicroelectronics; MP: STM32G431CBU6; Check_prices: https://www.snapeda.com/parts/STM32G431CBU6/STMicroelectronics/view-part/?ref=eda; Source: STM32G431CBU6.SchLib; Pins: 49; Value: *; SnapEDA_Link: https://www.snapeda.com/parts/STM32G431CBU6/STMicroelectronics/view-part/?ref=snap; Design Item ID: STM32G431CBU6; Component Type: Standard
U2 = CMP-011-00123-3: Switch Tactile N.O. SPST Round Button Gull Wing 0.05A 12VDC 1.5N SMD T/R; MP: B3U1000P; MF: Omron; Design Item ID: B3U-1000P; Value: *; Component Type: Standard; Check_prices: https://www.snapeda.com/parts/B3U1000P/Omron/view-part/?ref=eda; SnapEDA_Link: https://www.snapeda.com/parts/B3U1000P/Omron/view-part/?ref=snap; Pins: 2; Case/Package: None; Source: B3U-1000P.SchLib
Y1 = CMP-003-00059-1: CRYSTAL 8MHZ 8PF SMD; Manufacturer: NDK; Manufacturer Part Number: NX3225SA-25.000M-STD-CRS-2; Automotive Grade: Grade 1; Tolerance: 15ppm; Esr: 100; Series: NX3225SA; Device Class L2: Crystals / Oscillators; Temperature Range High: 125°C; Category: Crys; Height: 0.6mm; Device Class L3: Crystals; Device Class L1: Passive Components; Load Capacitance: 8pF; Octopart: https://octopart.com/nx3225sa-25.000m-std-crs-2-ndk-51374293; Automotive: Yes; Temperature: -40°C to +125°C; Component Type: Standard; Source: Components - 28.03.25 - 23.15.SchLib; Digikey Description: CRYSTAL 40MHZ 8PF SMD; Design Item ID: CMP-200220-000002-1; Temperature Range Low: -40°C; Frequency: 8MHz; Case/Package: NX3225SA; RoHS: TRUE; Pins: 4; Lead Free: Yes
Y2 = CMP-003-00053-1: Parallel - Fundamental Quartz Crystal, 0.032768MHz Nom; Frequency Stability: 0.0144%; Load Capacitance: 12.5pF; Frequency Tolerance: 20ppm; Min Operating Temperature: -40°C; Max Operating Temperature: 85°C

## Sheet OLED.SchDoc
size B; SheetNumber: 14; SheetTotal: 15
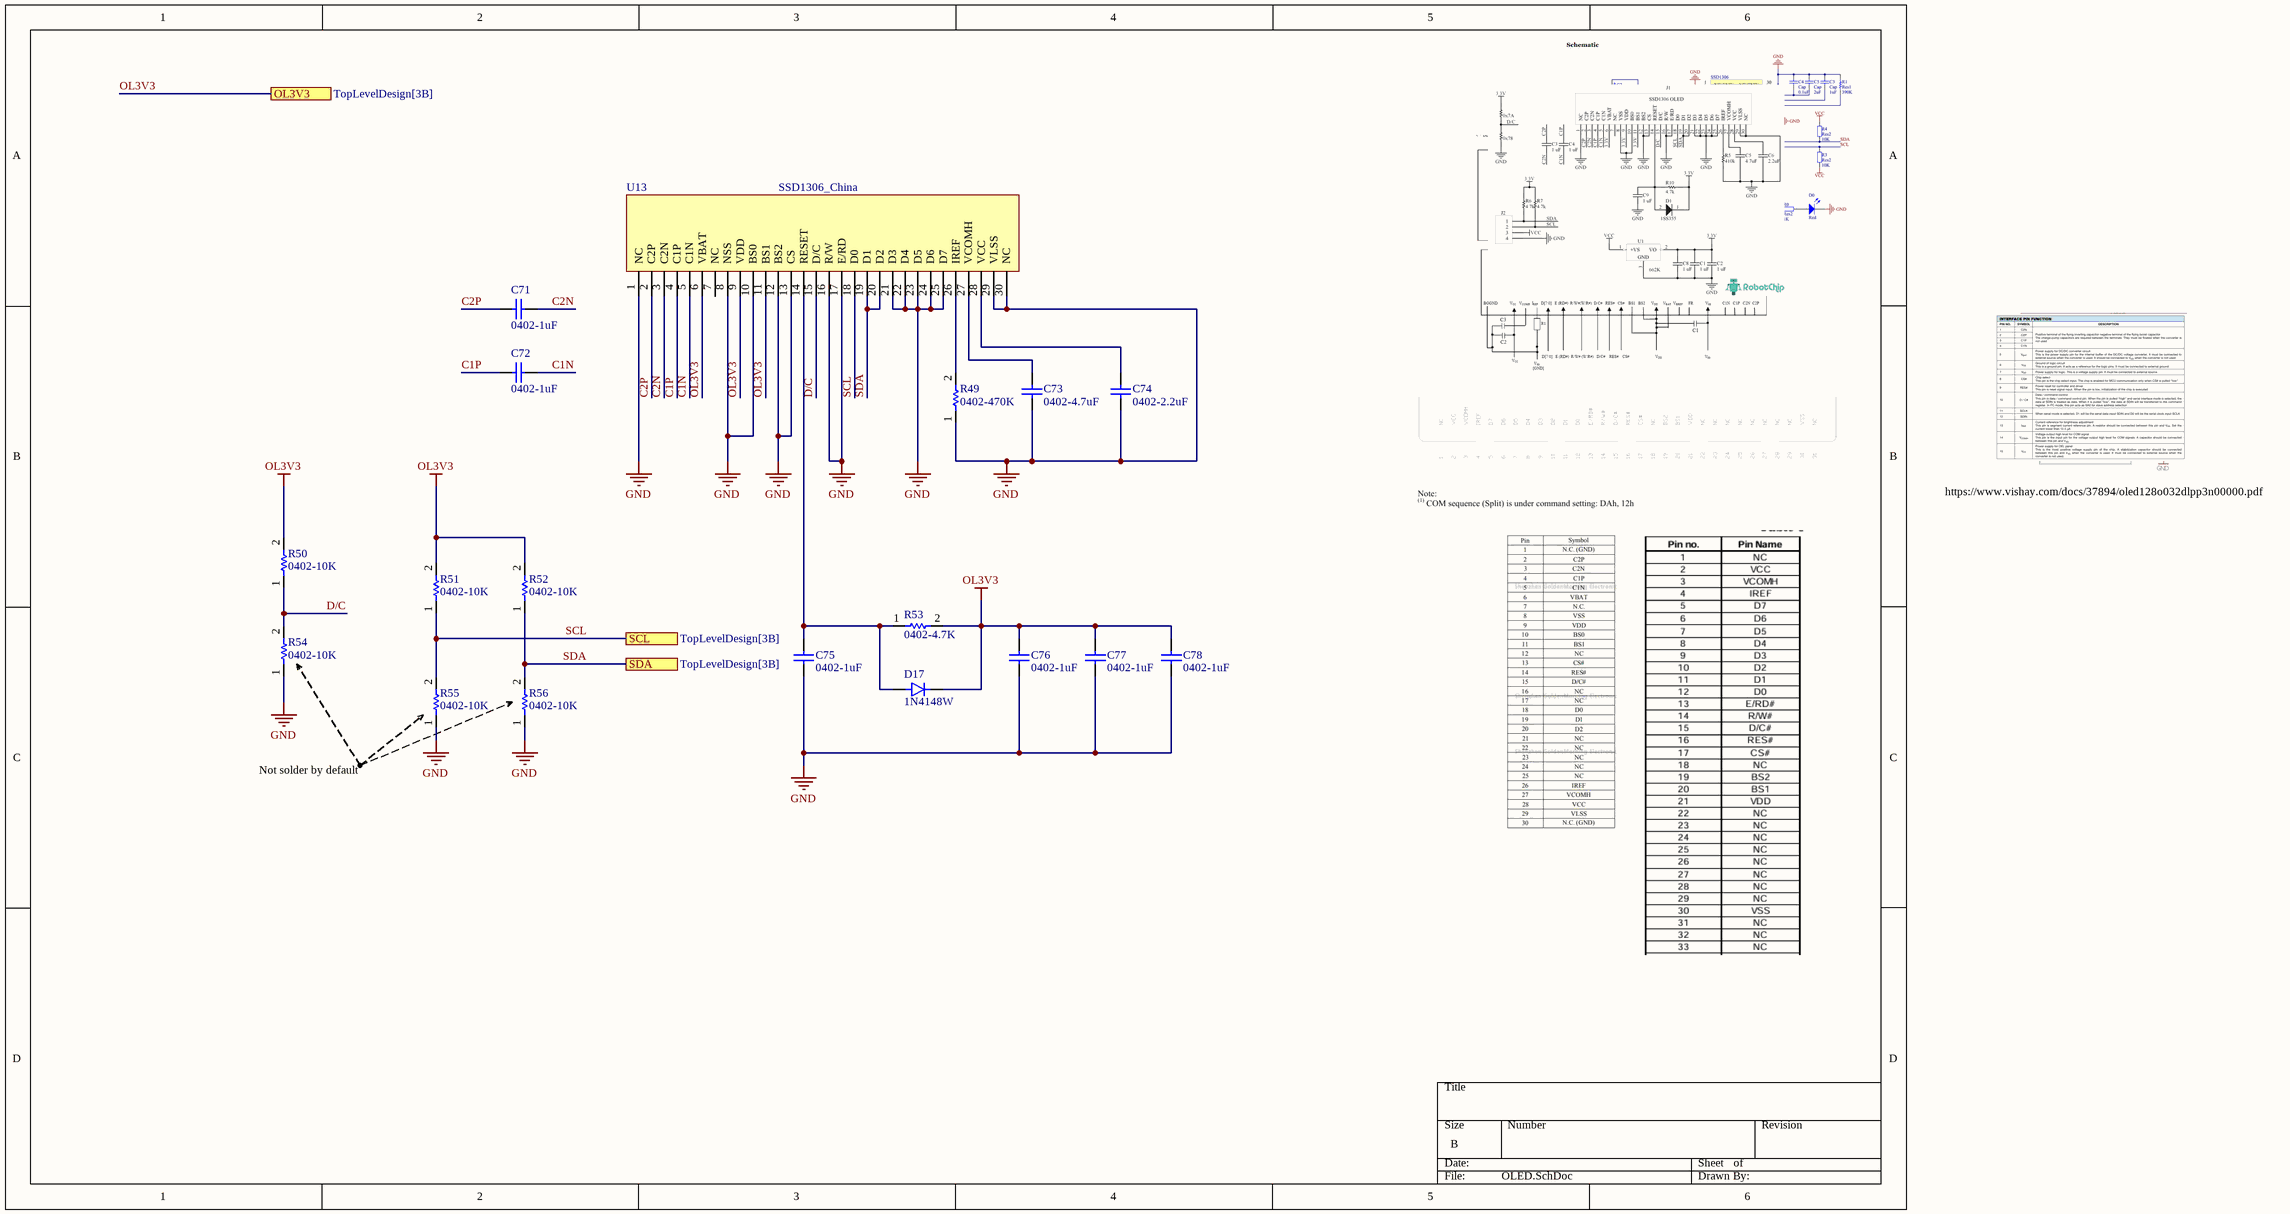
[diagram p4: OLED.SchDoc]

### Parts
C71  0402-1uF  [CAPC0402(1005)60_N]
C72  0402-1uF  [CAPC0402(1005)60_N]
C73  0402-4.7uF  [CAPC0402(1005)60_N]
C74  0402-2.2uF  [CAPC0402(1005)60_N]
C75  0402-1uF  [CAPC0402(1005)60_N]
C76  0402-1uF  [CAPC0402(1005)60_N]
C77  0402-1uF  [CAPC0402(1005)60_N]
C78  0402-1uF  [CAPC0402(1005)60_N]
D17  1N4148W  [SODFL3816X120N]
R49  0402-470K  [R-0402-10K]
R50  0402-10K  [R-0402-10K]
R51  0402-10K  [R-0402-10K]
R52  0402-10K  [R-0402-10K]
R53  0402-4.7K  [R-0402-10K]
R54  0402-10K  [R-0402-10K]
R55  0402-10K  [R-0402-10K]
R56  0402-10K  [R-0402-10K]
U13  SSD1306_China  [SSD1306_China-Footprint-1]

### Ports
OL3V3 (see TopLevelDesign[3B]), SCL (see TopLevelDesign[3B]), SDA (see TopLevelDesign[3B])

### Nets
GND: C73.1 C74.1 C75.1 C76.1 C77.1 C78.1 R49.1 R54.1 R55.1 R56.1 U13.1(NC) U13.8(NSS) U13.10(BS0) U13.12(BS2) U13.13(CS) U13.16(R/W) U13.17(E/RD) U13.21(D3) U13.22(D4) U13.23(D5) U13.24(D6) U13.25(D7) U13.29(VLSS) U13.30(NC)
OL3V3: C76.2 C77.2 C78.2 D17.C(K) R50.2 R51.2 R52.2 R53.2 U13.6(VBAT) U13.9(VDD) U13.11(BS1) ; port OL3V3
C1N: C72.1 U13.5(C1N)
C1P: C72.2 U13.4(C1P)
C2N: C71.1 U13.3(C2N)
C2P: C71.2 U13.2(C2P)
D/C: R50.1 R54.2 U13.15(D/C)
SCL: R51.1 R55.2 U13.18(D0) ; port SCL
SDA: R52.1 R56.2 U13.19(D1) U13.20(D2) ; port SDA
NetC73_2: C73.2 U13.27(VCOMH)
NetC74_2: C74.2 U13.28(VCC)
NetC75_2: C75.2 D17.A R53.1 U13.14(RESET)
NetR49_2: R49.2 U13.26(IREF)

Not connected (* = marked no-connect by the designer): U13 7(NC)

### Notes on the sheet
- https://www.vishay.com/docs/37894/oled128o032dlpp3n00000.pdf
- Not solder by default

### Library data of the parts
C71 C72 C75-C78 = CMP-001-00353-3: Capacitor 1uF 0402s; Voltage Rating: 4V; Value: 1µF; Tolerance: 20%; Dielectric: X5R; Pins: 2; Component Type: Standard; Packaging: Tape and Reel; Min Operating Temperature: -55°C; Voltage Rating (DC): 4V; Series: M; Height: 0.5mm; RoHS Compliant: Yes; Case/Package: 0402; Thickness: 0.028inch; Design Item ID: CMP-1034-02139-2; Length: 0.039inch; Max Operating Temperature: 85°C; Termination: SMD/SMT; Package Quantity: 1; Width: 0.02inch; Halogen Free: Halogen Free; Source: 0402-10uF.SchLib; Construction: Flat; Mount: Surface Mount; Case Code (Metric): 1005
C73 = CMP-001-00364-1: as C7 on sheet MCU; Series: M; Width: 0.02inch; Halogen Free: Halogen Free; Construction: Flat; Pins: 2; Min Operating Temperature: -55°C; RoHS Compliant: Yes; Max Operating Temperature: 85°C; Thickness: 0.028inch; Package Quantity: 1; Mount: Surface Mount; Component Type: Standard; Packaging: Tape and Reel; Case Code (Metric): 1005; Case/Package: 0402; Voltage Rating (DC): 4V; Length: 0.039inch; Source: 0402-10uF.SchLib; Termination: SMD/SMT; Design Item ID: CMP-1034-02139-2; Height: 0.5mm
C74 = CMP-001-00356-1: Capacitor 2.2uF 0402; Voltage Rating (DC): 4V; Value: 2.2µF; Tolerance: 20%; Dielectric: X5R; Case/Package: 0402; Height: 0.5mm; Component Type: Standard; RoHS Compliant: Yes; Max Operating Temperature: 85°C; Thickness: 0.028inch; Series: M; Length: 0.039inch; Construction: Flat; Voltage Rating: 4V; Design Item ID: CMP-1034-02139-2; Case Code (Metric): 1005; Packaging: Tape and Reel; Mount: Surface Mount; Halogen Free: Halogen Free; Width: 0.02inch; Termination: SMD/SMT; Package Quantity: 1; Source: 0402-10uF.SchLib; Pins: 2; Min Operating Temperature: -55°C
D17 = CMP-004-00119-1: Value: *; Price: None; Source: 1N4148W.SchLib; MP: 1N4148W; Pins: 2; Package: None; Design Item ID: 1N4148W; Availability: Unavailable; Component Type: Standard
R49 = CMP-009-00676-1: RES 0402 470K; Value: 470k
R50-R52 R54-R56 = CMP-009-00675-4: RES 0402 10K; Value: 10k
R53 = CMP-009-00687-2: RES 0402 4.7K; Value: 4.7k
U13 = CMP-00001-1: SSD1306_China , 0.96 inch display

## Sheet Wifi.SchDoc
size B; SheetNumber: 15; SheetTotal: 15
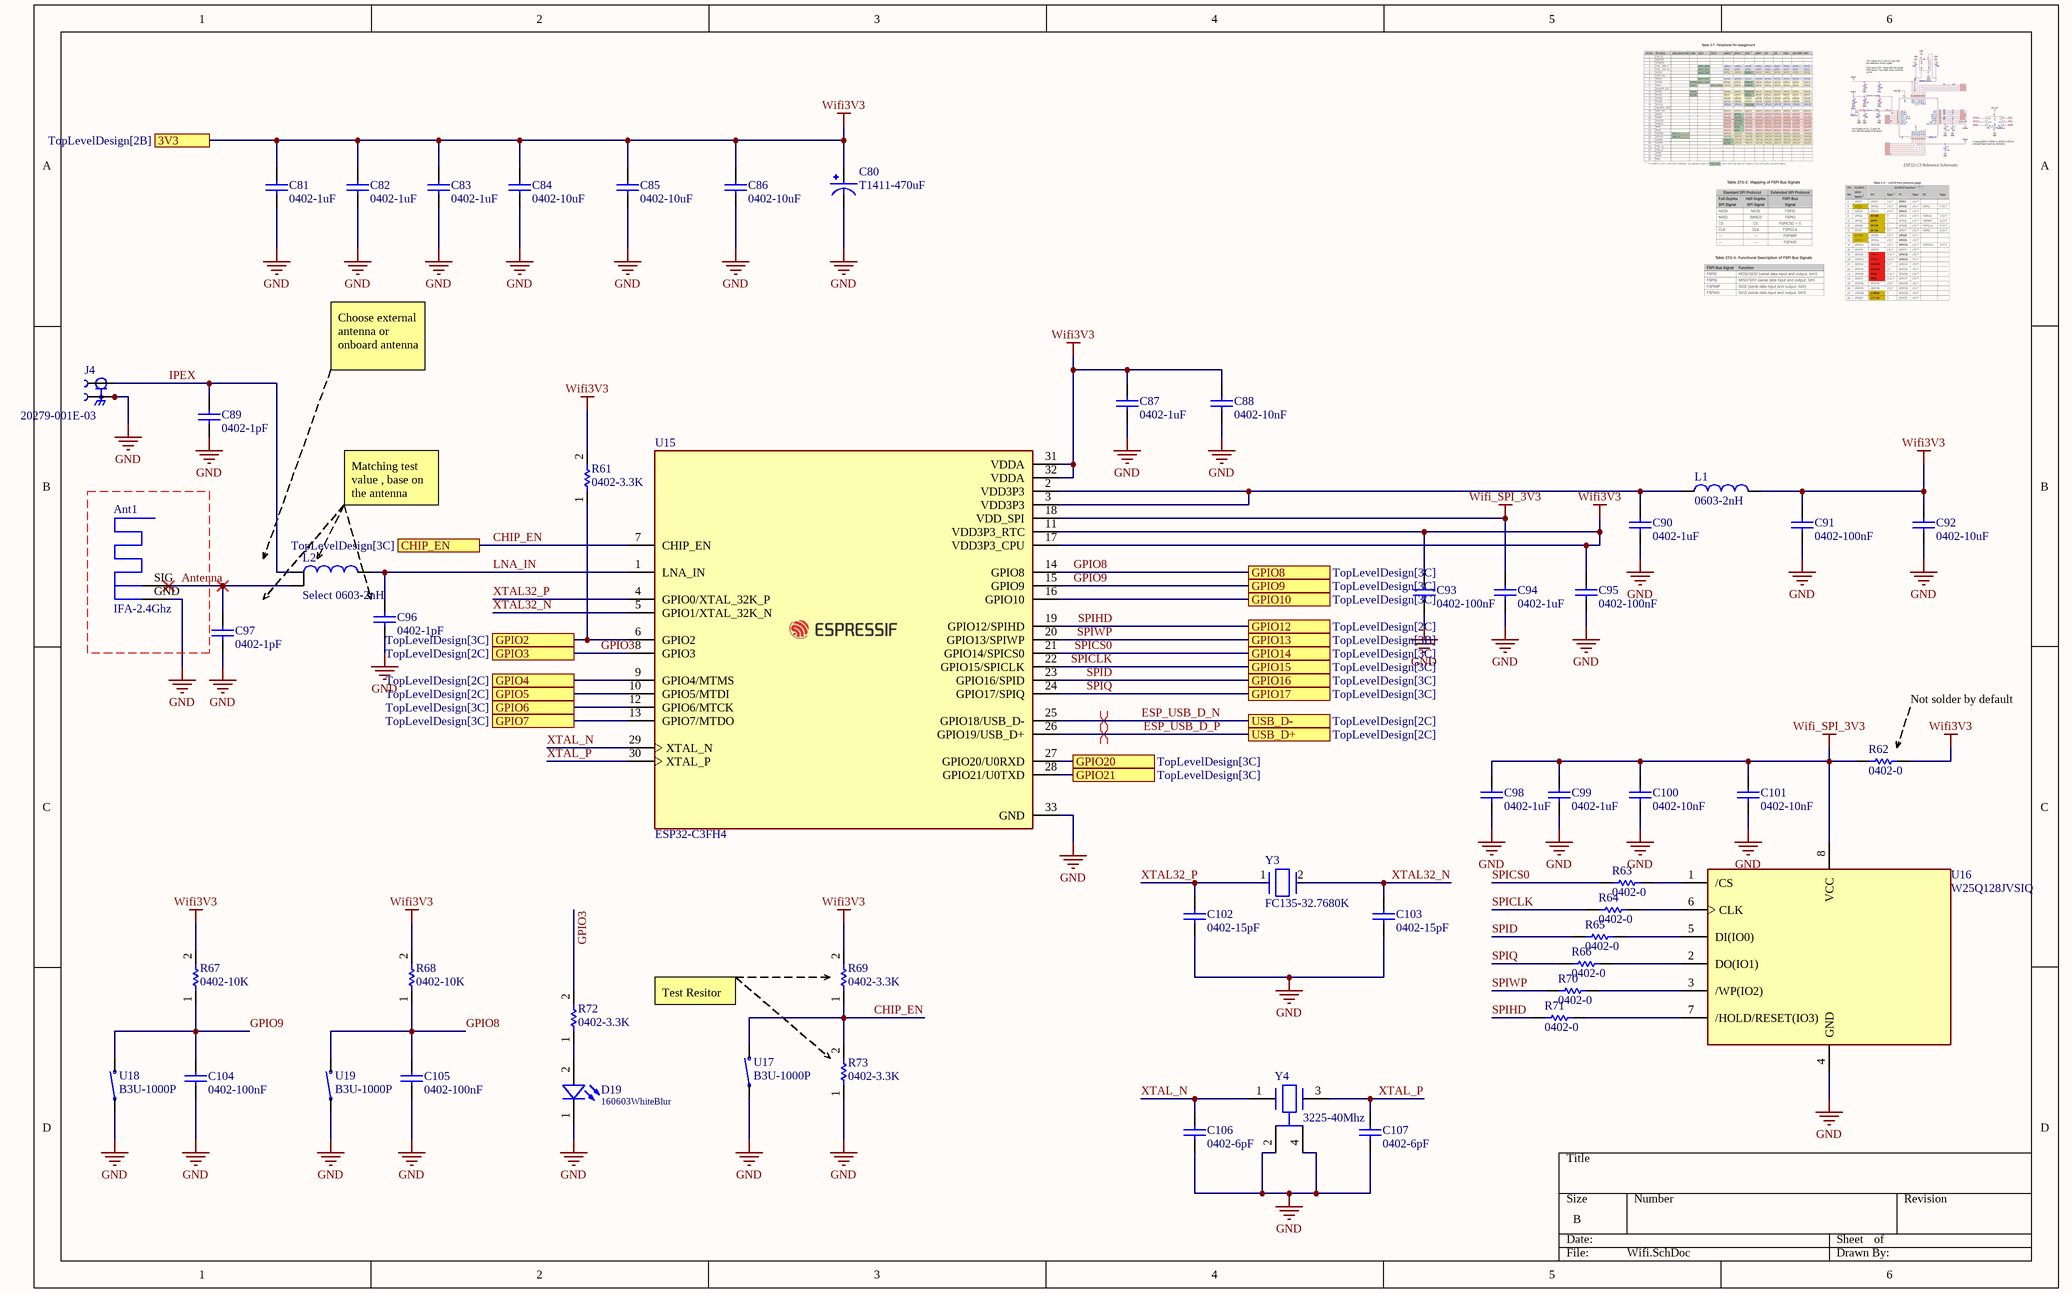
[diagram p5: Wifi.SchDoc]

### Parts
Ant1  IFA-2.4Ghz  [IFA-2.4Ghz-Footprint-1]
C80  T1411-470uF  [CAPPC3528X210N]
C81  0402-1uF  [CAPC0402(1005)60_N]
C82  0402-1uF  [CAPC0402(1005)60_N]
C83  0402-1uF  [CAPC0402(1005)60_N]
C84  0402-10uF  [CAPC0402(1005)60_N]
C85  0402-10uF  [CAPC0402(1005)60_N]
C86  0402-10uF  [CAPC0402(1005)60_N]
C87  0402-1uF  [CAPC0402(1005)60_N]
C88  0402-10nF  [CAPC0402(1005)60_N]
C89  0402-1pF  [CAPC0402(1005)60_N]
C90  0402-1uF  [CAPC0402(1005)60_N]
C91  0402-100nF  [CAPC0402(1005)60_N]
C92  0402-10uF  [CAPC0402(1005)60_N]
C93  0402-100nF  [CAPC0402(1005)60_N]
C94  0402-1uF  [CAPC0402(1005)60_N]
C95  0402-100nF  [CAPC0402(1005)60_N]
C96  0402-1pF  [CAPC0402(1005)60_N]
C97  0402-1pF  [CAPC0402(1005)60_N]
C98  0402-1uF  [CAPC0402(1005)60_N]
C99  0402-1uF  [CAPC0402(1005)60_N]
C100  0402-10nF  [CAPC0402(1005)60_N]
C101  0402-10nF  [CAPC0402(1005)60_N]
C102  0402-15pF  [CAPC0402(1005)60_N]
C103  0402-15pF  [CAPC0402(1005)60_N]
C104  0402-100nF  [CAPC0402(1005)60_N]
C105  0402-100nF  [CAPC0402(1005)60_N]
C106  0402-6pF  [CAPC0402(1005)60_N]
C107  0402-6pF  [CAPC0402(1005)60_N]
D19  160603WhiteBlur  [WL-SMCW_0603_H=0.7mm]
J4  20279-001E-03  [IPEX_20279-001E-03]
L1  0603-2nH  [INDC1608X80N]
L2  Select 0603-2nH  [Copy of INDC1608X80N]
R61  0402-3.3K  [R-0402-10K]
R62  0402-0  [R-0402-1K]
R63  0402-0  [R-0402-1K]
R64  0402-0  [R-0402-1K]
R65  0402-0  [R-0402-1K]
R66  0402-0  [R-0402-1K]
R67  0402-10K  [R-0402-10K]
R68  0402-10K  [R-0402-10K]
R69  0402-3.3K  [R-0402-10K]
R70  0402-0  [R-0402-1K]
R71  0402-0  [R-0402-1K]
R72  0402-3.3K  [R-0402-10K]
R73  0402-3.3K  [R-0402-10K]
U15  ESP32-C3FH4  [QFN50P500X500X90-33N]
U16  W25Q128JVSIQ  [SOIC127P790X216-8N]
U17  B3U-1000P  [SODFL4025X160N]
U18  B3U-1000P  [SODFL4025X160N]
U19  B3U-1000P  [SODFL4025X160N]
Y3  FC135-32.7680K  [FP-FC-135-MFG]
Y4  3225-40Mhz  [FP-NX3225SA-MFG]

### Ports
3V3 (see TopLevelDesign[2B]), CHIP_EN (see TopLevelDesign[3C]), GPIO2 (see TopLevelDesign[3C]), GPIO3 (see TopLevelDesign[2C]), GPIO4 (see TopLevelDesign[2C]), GPIO5 (see TopLevelDesign[2C]), GPIO6 (see TopLevelDesign[3C]), GPIO7 (see TopLevelDesign[3C]), GPIO8 (see TopLevelDesign[3C]), GPIO9 (see TopLevelDesign[3C]), GPIO10 (see TopLevelDesign[3C]), GPIO12 (see TopLevelDesign[2C]), GPIO13 (see TopLevelDesign[3B]), GPIO14 (see TopLevelDesign[3C]), GPIO15 (see TopLevelDesign[3C]), GPIO16 (see TopLevelDesign[3C]), GPIO17 (see TopLevelDesign[3C]), GPIO20 (see TopLevelDesign[3C]), GPIO21 (see TopLevelDesign[3C]), USB_D+ (see TopLevelDesign[2C]), USB_D- (see TopLevelDesign[2C])

### Nets
GND: Ant1.GND C80.2 C81.1 C82.1 C83.1 C84.1 C85.1 C86.1 C87.1 C88.1 C89.1 C90.1 C91.1 C92.1 C93.1 C94.1 C95.1 C96.1 C97.1 C98.1 C99.1 C100.1 C101.1 C102.1 C103.1 C104.1 C105.1 C106.1 C107.1 D19.1(K) J4.2(GROUND) J4.3(GROUND) R73.1 U15.33(GND) U16.4(GND) U17.1 U18.1 U19.1 Y4.2(GND) Y4.4(GND)
Wifi3V3: C80.1 C81.2 C82.2 C83.2 C84.2 C85.2 C86.2 C87.2 C88.2 C91.2 C92.2 C93.2 C95.2 L1.2 R61.2 R62.2 R67.2 R68.2 R69.2 U15.11(VDD3P3_RTC) U15.17(VDD3P3_CPU) U15.31(VDDA) U15.32(VDDA) ; port 3V3
Wifi_SPI_3V3: C94.2 C98.2 C99.2 C100.2 C101.2 R62.1 U15.18(VDD_SPI) U16.8(VCC)
Antenna: Ant1.SIG C97.2 L2.3
CHIP_EN: R69.1 R73.2 U15.7(CHIP_EN) U17.2 ; port CHIP_EN
ESP_USB_D_N: U15.25(GPIO18/USB_D-) ; port USB_D-
ESP_USB_D_P: U15.26(GPIO19/USB_D+) ; port USB_D+
GPIO3: R72.2 U15.8(GPIO3) ; port GPIO3
GPIO8: C105.2 R68.1 U15.14(GPIO8) U19.2 ; port GPIO8
GPIO9: C104.2 R67.1 U15.15(GPIO9) U18.2 ; port GPIO9
IPEX: C89.2 J4.1(SIGNAL) L2.1
LNA_IN: C96.2 L2.2 U15.1(LNA_IN)
SPICLK: R64.1 U15.22(GPIO15/SPICLK) ; port GPIO15
SPICS0: R63.1 U15.21(GPIO14/SPICS0) ; port GPIO14
SPID: R65.1 U15.23(GPIO16/SPID) ; port GPIO16
SPIHD: R71.1 U15.19(GPIO12/SPIHD) ; port GPIO12
SPIQ: R66.1 U15.24(GPIO17/SPIQ) ; port GPIO17
SPIWP: R70.1 U15.20(GPIO13/SPIWP) ; port GPIO13
XTAL32_N: C103.2 U15.5(GPIO1/XTAL_32K_N) Y3.2
XTAL32_P: C102.2 U15.4(GPIO0/XTAL_32K_P) Y3.1
XTAL_N: C106.2 U15.29(XTAL_N) Y4.1
XTAL_P: C107.2 U15.30(XTAL_P) Y4.3
NetC90_2: C90.2 L1.1 U15.2(VDD3P3) U15.3(VDD3P3)
NetD19_2: D19.2(A) R72.1
NetR61_1: R61.1 U15.6(GPIO2) ; port GPIO2
NetR63_2: R63.2 U16.1(/CS)
NetR64_2: R64.2 U16.6(CLK)
NetR65_2: R65.2 U16.5(DI(IO0))
NetR66_2: R66.2 U16.2(DO(IO1))
NetR70_2: R70.2 U16.3(/WP(IO2))
NetR71_2: R71.2 U16.7(/HOLD/RESET(IO3))
NetU15_9: U15.9(GPIO4/MTMS) ; port GPIO4
NetU15_10: U15.10(GPIO5/MTDI) ; port GPIO5
NetU15_12: U15.12(GPIO6/MTCK) ; port GPIO6
NetU15_13: U15.13(GPIO7/MTDO) ; port GPIO7
NetU15_16: U15.16(GPIO10) ; port GPIO10
NetU15_27: U15.27(GPIO20/U0RXD) ; port GPIO20
NetU15_28: U15.28(GPIO21/U0TXD) ; port GPIO21

### Layout directives
differential pair: ESP_USB_D_N, ESP_USB_D_P

### Notes on the sheet
- Choose external antenna or onboard antenna
- Matching test value , base on the antenna
- Not solder by default
- Test Resitor

### Library data of the parts
Ant1 = CMP-240-000001-3: Antenna Invert F 2.4Ghz; Pin Count: 2; Component Type: Standard; Source: IFA2.4GHZ.SchLib; Design Item ID: IFA-2.4Ghz
C80 = CMP-001-00375-1: as C1 on sheet MCU; SnapEDA_Link: https://www.snapeda.com/parts/TCJB106M025R0150/AVX/view-part/?ref=snap; Check_prices: https://www.snapeda.com/parts/TCJB106M025R0150/AVX/view-part/?ref=eda; Pins: 2; Design Item ID: TCJB106M025R0150; Component Type: Standard; Source: TCJB106M025R0150.SchLib; Case/Package: 1210 AVX
C81-C83 C87 C90 C94 C98 C99 = CMP-001-00353-3: as C71 on sheet OLED; Pins: 2; Component Type: Standard; Packaging: Tape and Reel; Min Operating Temperature: -55°C; Voltage Rating (DC): 4V; Series: M; Height: 0.5mm; RoHS Compliant: Yes; Case/Package: 0402; Thickness: 0.028inch; Design Item ID: CMP-1034-02139-2; Length: 0.039inch; Max Operating Temperature: 85°C; Termination: SMD/SMT; Package Quantity: 1; Width: 0.02inch; Halogen Free: Halogen Free; Source: 0402-10uF.SchLib; Construction: Flat; Mount: Surface Mount; Case Code (Metric): 1005
C84-C86 C92 = CMP-001-00352-3: as C69 on sheet USB; Width: 0.02inch; Packaging: Tape and Reel; RoHS Compliant: Yes; Series: M; Mount: Surface Mount; Termination: SMD/SMT; Source: 0402-10uF.SchLib; Design Item ID: CMP-1034-02139-2; Min Operating Temperature: -55°C; Construction: Flat; Component Type: Standard; Case Code (Metric): 1005; Length: 0.039inch; Height: 0.5mm; Pins: 2; Thickness: 0.028inch; Voltage Rating: 4V; Package Quantity: 1; Max Operating Temperature: 85°C; Halogen Free: Halogen Free; Case/Package: 0402
C88 C100 C101 = CMP-001-00355-4: Capacitor 10nF 0402; Tolerance: 20%; Dielectric: X5R; Voltage Rating (DC): 4V; Height: 0.5mm; Mount: Surface Mount; Min Operating Temperature: -55°C; Max Operating Temperature: 85°C; RoHS Compliant: Yes; Source: 0402-10uF.SchLib; Width: 0.02inch; Pins: 2; Value: 10nF; Case/Package: 0402; Halogen Free: Halogen Free; Case Code (Metric): 1005; Construction: Flat; Termination: SMD/SMT; Design Item ID: CMP-1034-02139-2; Component Type: Standard; Thickness: 0.028inch; Packaging: Tape and Reel; Series: M; Package Quantity: 1; Length: 0.039inch; Voltage Rating: 4V
C89 C96 C97 = CMP-001-00361-3: Capacitor 1pF 0402; Voltage Rating: 4V; Dielectric: X5R; Tolerance: 20%; Thickness: 0.028inch; Source: 0402-10uF.SchLib; Series: M; Design Item ID: CMP-1034-02139-2; Halogen Free: Halogen Free; RoHS Compliant: Yes; Min Operating Temperature: -55°C; Case Code (Metric): 1005; Voltage Rating (DC): 4V; Value: 1pF; Width: 0.02inch; Max Operating Temperature: 85°C; Pins: 2; Construction: Flat; Mount: Surface Mount; Height: 0.5mm; Termination: SMD/SMT; Package Quantity: 1; Case/Package: 0402; Component Type: Standard; Packaging: Tape and Reel; Length: 0.039inch
C91 C93 C95 C104 C105 = CMP-001-00354-3: as C70 on sheet USB; Series: M; RoHS Compliant: Yes; Max Operating Temperature: 85°C; Length: 0.039inch; Thickness: 0.028inch; Mount: Surface Mount; Min Operating Temperature: -55°C; Height: 0.5mm; Packaging: Tape and Reel; Construction: Flat; Termination: SMD/SMT; Source: 0402-10uF.SchLib; Design Item ID: CMP-1034-02139-2; Case/Package: 0402; Voltage Rating: 4V; Pins: 2; Value: 100nF; Width: 0.02inch; Component Type: Standard; Package Quantity: 1; Halogen Free: Halogen Free; Case Code (Metric): 1005
C102 C103 = CMP-001-00374-1: as C20 on sheet MCU; Packaging: Tape and Reel; Length: 0.039inch; Max Operating Temperature: 85°C; Design Item ID: CMP-1034-02139-2; Value: 15pF; Min Operating Temperature: -55°C; Case Code (Metric): 1005; Voltage Rating (DC): 4V; Case/Package: 0402; RoHS Compliant: Yes; Height: 0.5mm; Halogen Free: Halogen Free; Construction: Flat; Thickness: 0.028inch; Component Type: Standard; Source: 0402-10uF.SchLib; Termination: SMD/SMT; Mount: Surface Mount; Width: 0.02inch; Pins: 2; Series: M; Package Quantity: 1
C106 C107 = CMP-001-00362-3: as C18 on sheet MCU; Source: 0402-10uF.SchLib; Case Code (Metric): 1005; Case/Package: 0402; Mount: Surface Mount; Component Type: Standard; Packaging: Tape and Reel; Construction: Flat; RoHS Compliant: Yes; Series: M; Width: 0.02inch; Max Operating Temperature: 85°C; Min Operating Temperature: -55°C; Pins: 2; Height: 0.5mm; Package Quantity: 1; Length: 0.039inch; Thickness: 0.028inch; Value: 6pF; Design Item ID: CMP-1034-02139-2; Halogen Free: Halogen Free; Termination: SMD/SMT; Voltage Rating (DC): 4V
D19 = CMP-004-00095-1: as D1 on sheet TopLevelDesign; ComponentLink3Description: Supplier 2 URL; Design Item ID: 160603WhiteBlur; Component Type: Standard; Size: 0603; Supplier 1 SN: 755-SMLEN3WBC8W1; Color: White; Supplier 3 Name: ICDayRoi; Supplier 3 URL: N/A; Pins: 2; Supplier 2 URL: https://www.digikey.com/en/products/detail/qt-brightek-qtb/QBLP601-IW/4814655; ComponentLink1URL: N/A; ComponentLink3URL: https://www.digikey.com/en/products/detail/qt-brightek-qtb/QBLP601-IW/4814655; Supplier 1 URL: https://www.mouser.vn/ProductDetail/ROHM-Semiconductor/SMLEN3WBC8W1?qs=W0yvOO0ixfGun78rr9Unsw%3D%3D; ComponentLink2URL: https://www.mouser.vn/ProductDetail/ROHM-Semiconductor/SMLEN3WBC8W1?qs=W0yvOO0ixfGun78rr9Unsw%3D%3D; ComponentLink4Description: Supplier 3 URL; Supplier 1 Name: Mouser; Supplier 3 SN: N/A; ComponentLink4URL: N/A; Source: WL-SMCW_0603.SchLib; Supplier 2 SN: 1516-1057-2-ND; Value: White; Supplier 2 Name: Digi-Key; ComponentLink2Description: Supplier 1 URL; ComponentLink1Description: Datasheet link; Type: Blur
J4 = CMP-002-01573-1: 1 POS Vertical SMD Small form factor with big performance through 6 GHz connector,MHF, RF, micro-coaxial MHF I Receptacle; MF: I-PEX; Value: *; Source: 20279-001E-03.SchLib; Component Type: Standard; Design Item ID: 20279-001E-03; Pins: 3; Check_prices: https://www.snapeda.com/parts/20279-001E-03/I-PEX/view-part/?ref=eda; SnapEDA_Link: https://www.snapeda.com/parts/20279-001E-03/I-PEX/view-part/?ref=snap; Case/Package: None; MP: 20279-001E-03
L1 = CMP-006-00351-2: Value: 2nH; Case/Package: None; Availability: Unavailable; Component Type: Standard; ComponentLink2Description: Website Link; MP: DFE18SBN1R0ME0L; Price: None; Source: DFE18SBN1R0ME0L.SchLib; Design Item ID: DFE18SBN1R0ME0L; ComponentLink1Description: Datasheet Link; Pins: 2
L2 = CMP-006-00364-1: 0603-2nH Selected; Value: 2nH; Component Type: Standard; Source: DFE18SBN1R0ME0L.SchLib; ComponentLink2Description: Website Link; ComponentLink1Description: Datasheet Link; MP: DFE18SBN1R0ME0L; Price: None; Pins: 2; Case/Package: None; Design Item ID: DFE18SBN1R0ME0L; Availability: Unavailable
R61 R69 R72 R73 = CMP-009-00688-1: RES 0402 3.3K; Value: 3.3k
R62-R66 R70 R71 = CMP-009-00678-4: 0402Resistor 0 Ohm; Value: 0
R67 R68 = CMP-009-00675-4: RES 0402 10K; Value: 10k
U15 = CMP-031-00018-2: Design Item ID: ESP32-C3FH4; Value: *; Component Type: Standard; MP: ESP32-C3FH4; Source: ESP32-C3FH4.SchLib; Case/Package: None; Price: None; Availability: Unavailable; Pins: 33
U16 = CMP-031-00021-3: FLASH - NOR Memory IC 128Mb (16M x 8) SPI - Quad I/O, QPI, DTR 133 MHz 8-SOIC; MF: Winbond Electronics; Design Item ID: W25Q128JVSIQ; Case/Package: SOIC-8 Winbond Electronics; Component Type: Standard; MP: W25Q128JVSIQ; Check_prices: https://www.snapeda.com/parts/W25Q128JVSIQ/Winbond/view-part/?ref=eda; SnapEDA_Link: https://www.snapeda.com/parts/W25Q128JVSIQ/Winbond/view-part/?ref=snap; Source: W25Q128JVSIQ.SchLib; Value: *; Pins: 8
U17-U19 = CMP-011-00123-3: as U2 on sheet MCU; Design Item ID: B3U-1000P; Value: *; Component Type: Standard; Check_prices: https://www.snapeda.com/parts/B3U1000P/Omron/view-part/?ref=eda; SnapEDA_Link: https://www.snapeda.com/parts/B3U1000P/Omron/view-part/?ref=snap; Pins: 2; Case/Package: None; Source: B3U-1000P.SchLib
Y3 = CMP-003-00053-1: as Y2 on sheet MCU; Min Operating Temperature: -40°C; Max Operating Temperature: 85°C
Y4 = CMP-003-00058-1: CRYSTAL 40MHZ 8PF SMD; Manufacturer: NDK; Manufacturer Part Number: NX3225SA-25.000M-STD-CRS-2; Tolerance: 15ppm; Automotive Grade: Grade 1; Esr: 100; Series: NX3225SA; RoHS: TRUE; Pins: 4; Load Capacitance: 8pF; Digikey Description: CRYSTAL 40MHZ 8PF SMD; Device Class L2: Crystals / Oscillators; Category: Crys; Component Type: Standard; Case/Package: NX3225SA; Height: 0.6mm; Frequency: 40MHz; Octopart: https://octopart.com/nx3225sa-25.000m-std-crs-2-ndk-51374293; Temperature: -40°C to +125°C; Temperature Range High: 125°C; Source: Components - 28.03.25 - 23.15.SchLib; Design Item ID: CMP-200220-000002-1; Device Class L1: Passive Components; Temperature Range Low: -40°C; Device Class L3: Crystals; Automotive: Yes; Lead Free: Yes

## Sheet Power.SchDoc
size B; SheetNumber: 8; SheetTotal: 15
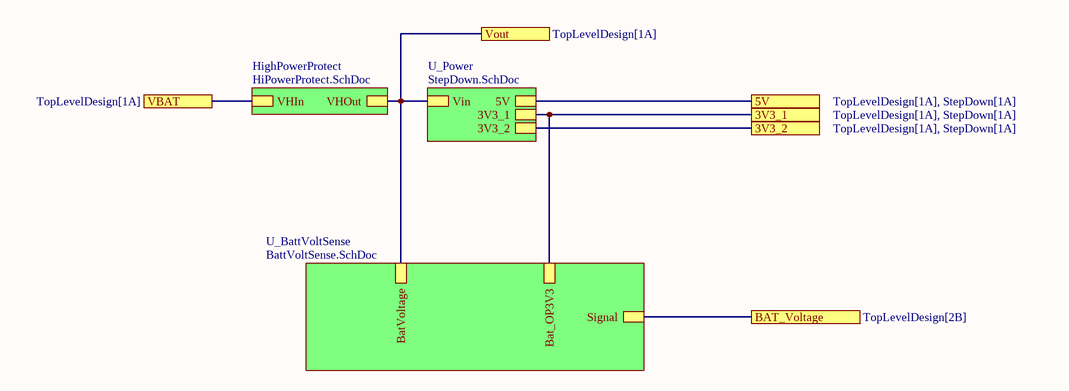
[diagram p6: Power.SchDoc]

### Sub-sheets
HighPowerProtect = HiPowerProtect.SchDoc: VHIn, VHOut
U_BattVoltSense = BattVoltSense.SchDoc: BatVoltage, Signal, Bat_OP3V3
U_Power = StepDown.SchDoc: Vin, 5V, 3V3_1, 3V3_2

### Ports
3V3_1 (see TopLevelDesign[1A], StepDown[1A]), 3V3_2 (see TopLevelDesign[1A], StepDown[1A]), 5V (see TopLevelDesign[1A], StepDown[1A]), BAT_Voltage (see TopLevelDesign[2B]), VBAT (see TopLevelDesign[1A]), Vout (see TopLevelDesign[1A])

### Nets
3V3_1Power: port 3V3_1, sheet U_Power/3V3_1, sheet U_BattVoltSense/Bat_OP3V3
3V3_2Power: port 3V3_2, sheet U_Power/3V3_2
5VPower: port 5V, sheet U_Power/5V
NetR26_I_PhaseA_2: port Vout, sheet HighPowerProtect/VHOut, sheet U_Power/Vin, sheet U_BattVoltSense/BatVoltage
(unnamed): port VBAT, sheet HighPowerProtect/VHIn
(unnamed): port BAT_Voltage, sheet U_BattVoltSense/Signal

## Sheet HiPowerProtect.SchDoc
size B; SheetNumber: 12; SheetTotal: 15
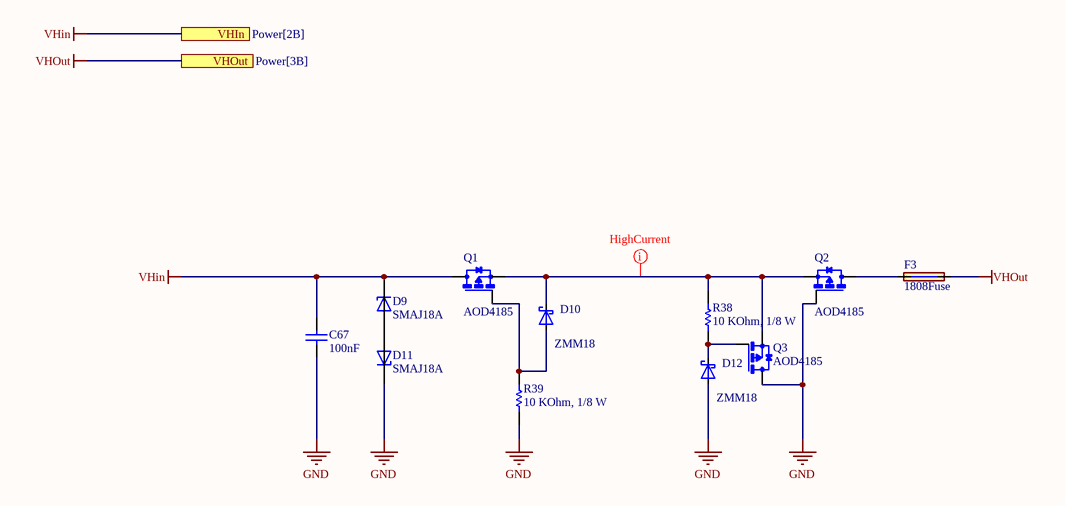
[diagram p7: HiPowerProtect.SchDoc]

### Parts
C67  value 100nF  [CAP_0805]  (hidden comment: 0108051041050)
D9  SMAJ18A  [DIOM4325X250N]
D10  ZMM18  [SOD-80_MiniMELF_Glass]
D11  SMAJ18A  [DIOM4325X250N]
D12  ZMM18  [SOD-80_MiniMELF_Glass]
F3  1808Fuse  [0154007.DR]
Q1  AOD4185  [DPAK]
Q2  AOD4185  [DPAK]
Q3  AOD4185  [DPAK]
R38  value 10 KOhm, 1/8 W  [RESISTOR_0805]  (hidden comment: 0008051031)
R39  value 10 KOhm, 1/8 W  [RESISTOR_0805]  (hidden comment: 0008051031)

### Ports
VHIn (see Power[2B]), VHOut (see Power[3B])

### Nets
GND: C67.1 D11.C D12.A Q2.1(G) Q3.4(D) R39.1
VHin: C67.2 D9.C Q1.4(D) ; port VHIn
VHOut: F3.2 ; port VHOut
NetD9_A: D9.A D11.A
NetD10_A: D10.A Q1.1(G) R39.2
NetD10_K: D10.K Q1.3(S) Q2.3(S) Q3.3(S) R38.2
NetD12_K: D12.K Q3.1(G) R38.1
NetF3_1: F3.1 Q2.4(D)

### Layout directives
rule Width Constraint [Pref Width = 50mil    Min Width = 50mil    Max Width = 100mil]: NetD10_K

### Library data of the parts
C67 = CMP-001-00259-1: CAP, size 0805, 0.1 nF, 50 VDC; Manufacture Name: TDK; Manufacture SN: CGA4J2X8R1H104K125AD; Voltage Rating DC: 50 VDC; Tolerance: 10%; Pins: 2; Supplier 2 URL: https://www.digikey.com/en/products/detail/tdk-corporation/cga4j2x8r1h104k125ad/3248169; Supplier 1 SN: 810-C2012X8R1H104KEP; Supplier 1 Name: Mouser; Supplier 3 Name: thegioiic; Mounting Technology: SMT; Source: Capacitor_0805_10_percent.SchLib; Supplier 2 SN: 445-8810-2-ND; Supplier 3 SN: OEM; Operating Temperature: -55 to +125degC; Supplier 2 Name: Digi-Key; Component Type: Standard; Design Item ID: 0108051041050; Supplier 1 URL: https://www.mouser.vn/ProductDetail/TDK/CGA4J2X8R1H104K125AD?qs=LcTL%2F5vFEzExqZqv3rh1qQ%3D%3D&utm_source=mouser-refine-download&utm_medium=file&utm_campaign=CGA4J2X8R1H104K125AD&utm_content=TDK; Supplier 3 URL: N/A; Packaging: Tape and Reel; Size: 0805
D9 D11 = CMP-004-00085-1: 400W, 21.1V, 5%, Unidirectional, TVS; MF: Taiwan Semiconductor; SnapEDA_Link: https://www.snapeda.com/parts/SMAJ18A/taiwan/view-part/?ref=snap; Value: *; Component Type: Standard; Case/Package: SMA-2 Taiwan Semiconductor; Check_prices: https://www.snapeda.com/parts/SMAJ18A/taiwan/view-part/?ref=eda; Source: SMAJ18A.SchLib; Design Item ID: SMAJ18A; Pins: 2; MP: SMAJ18A
D10 D12 = CMP-004-00086-2: Value: Shottky-Diode; Reference: D; ki_keywords: Schottky; ki_description: Schottky Diode; Component Type: Standard; Pins: 2; Source: schottky-diode.SchLib; Design Item ID: Schottky-Diode; Datasheet: https://diotec.com/de/produktliste/SBD.html
F3 = CMP-005-00062-2: Fuse 1808 with case; MF: Littelfuse Inc.; Price: None; Purchase-URL: https://pricing.snapeda.com/search?q=0154007.DR&ref=eda; Check_prices: https://www.snapeda.com/parts/0154007.DR/Littelfuse+Inc./view-part/?ref=eda; MP: 0154007.DR; Source: 0154007.DR.SchLib; Design Item ID: 0154007.DR; Case/Package: SMD-2 Littelfuse; Component Type: Standard; Pins: 2; Value: *; Availability: In Stock; SnapEDA_Link: https://www.snapeda.com/parts/0154007.DR/Littelfuse+Inc./view-part/?ref=snap
Q1-Q3 = CMP-123-000001-2: P-Channel 40V 40A (Tc) 2.5W (Ta), 62.5W (Tc) Surface Mount TO-252, (D-Pak); MF: Alpha &; Check_prices: https://www.snapeda.com/parts/AOD4185/Alpha/view-part/?ref=eda; MP: AOD4185; Package: TO-252 Alpha &amp; Omega Semiconductor; SnapEDA_Link: https://www.snapeda.com/parts/AOD4185/Alpha/view-part/?ref=snap; Design Item ID: AOD4185; Source: AOD4185.SchLib; Pin Count: 3; Value: *; Component Type: Standard
R38 R39 = CMP-009-00482-1: RES, size 0805, 10 KOhm, 1/8 W; Manufacture  Name: Vishay Dale; Manufacture  SN: CRCW080515K0FKEAC; Rated Power: 1/8 W; Resistance Tolerance: +/-1%; ComponentLink3URL: https://www.digikey.com/en/products/detail/vishay-dale/CRCW080515K0FKEAC/7928558; Supplier 3 SN: N/A; ComponentLink1URL: https://www.vishay.com/docs/28773/crcwce3.pdf; ComponentLink2Description: Supplier 1 URL; Mounting Technology: SMT; Supplier 1 SN: 71-CRCW0805-15K-E3; ComponentLink3Description: Supplier 2 URL; Pins: 2; Size: 0805; ComponentLink1Description: Datasheet link; Supplier 3 URL: N/A; Source: Resistor_0805.SchLib; Supplier 2 URL: https://www.digikey.com/en/products/detail/vishay-dale/CRCW080515K0FKEAC/7928558; ComponentLink4URL: N/A; Supplier 1 URL: https://www.mouser.vn/ProductDetail/Vishay-Dale/CRCW080515K0FKEA?qs=bMjB6bAaLEM4rXT2DoR3BA%3D%3D; Supplier 1 Name: Mouser; Design Item ID: 0008051531; Supplier 2 SN: 541-4136-2-ND; Component Type: Standard; ComponentLink2URL: https://www.mouser.vn/ProductDetail/Vishay-Dale/CRCW080515K0FKEA?qs=bMjB6bAaLEM4rXT2DoR3BA%3D%3D; Supplier 2 Name: Digi-Key; ComponentLink4Description: Supplier 3 URL; Supplier 3 Name: Thegioiic